# EAGLE design 2021-02-15_HALO_Main_Board (EAGLE 9.1.3)
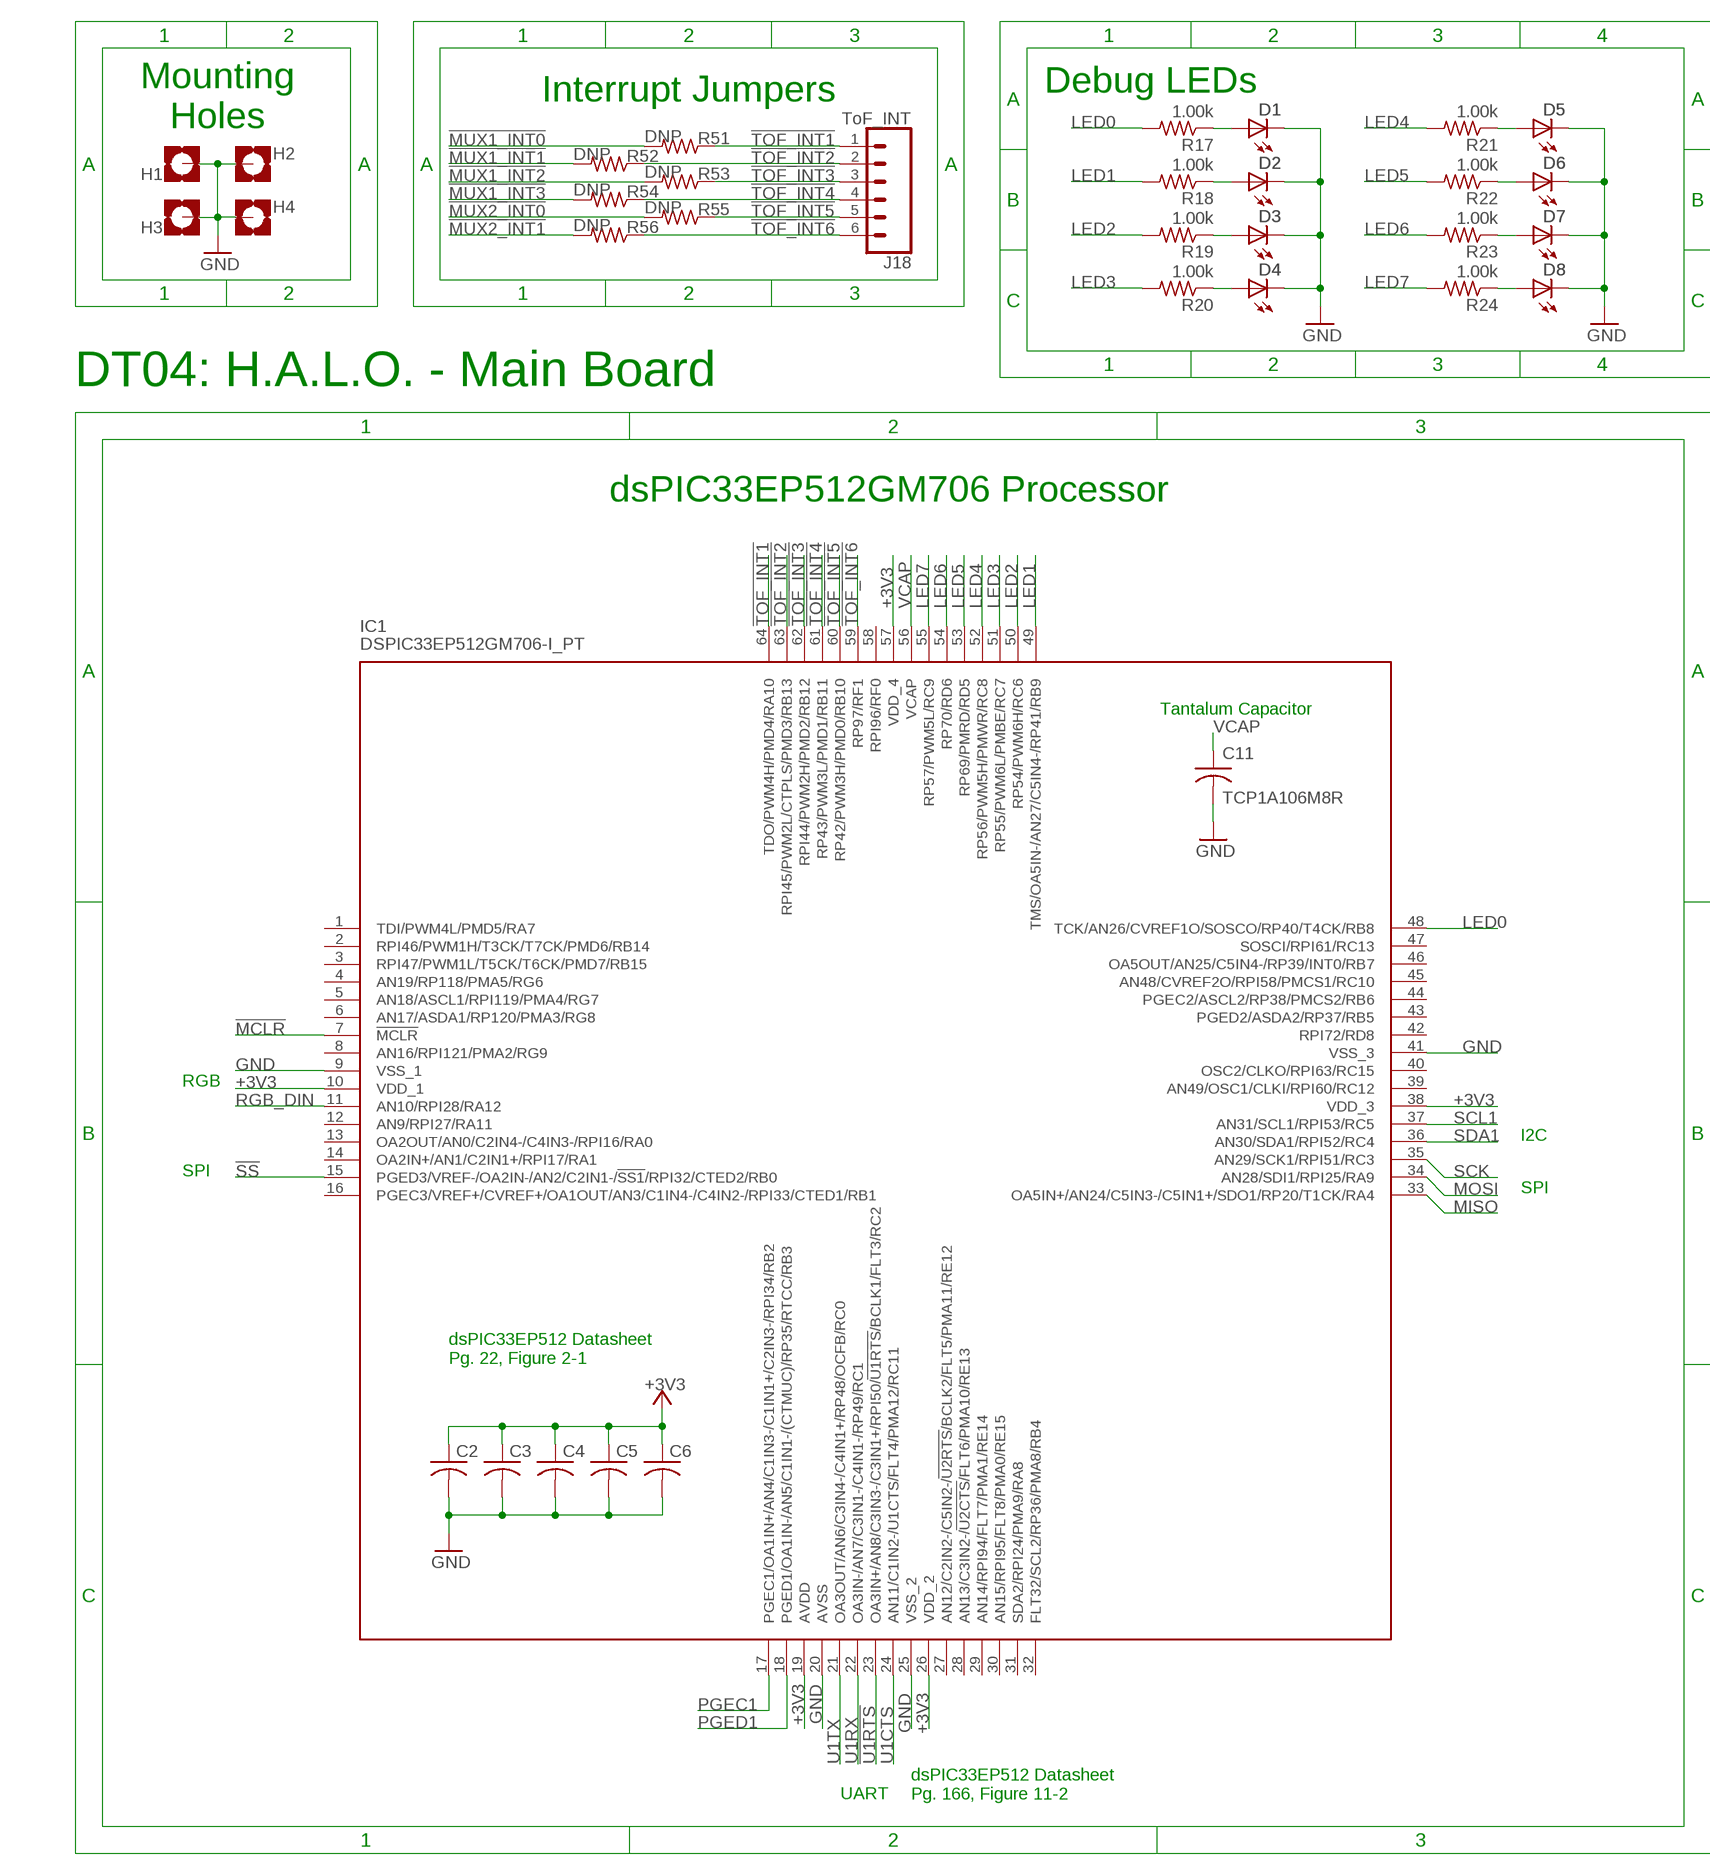
[diagram p0: schematic, sheet 1, part 1 of 2]
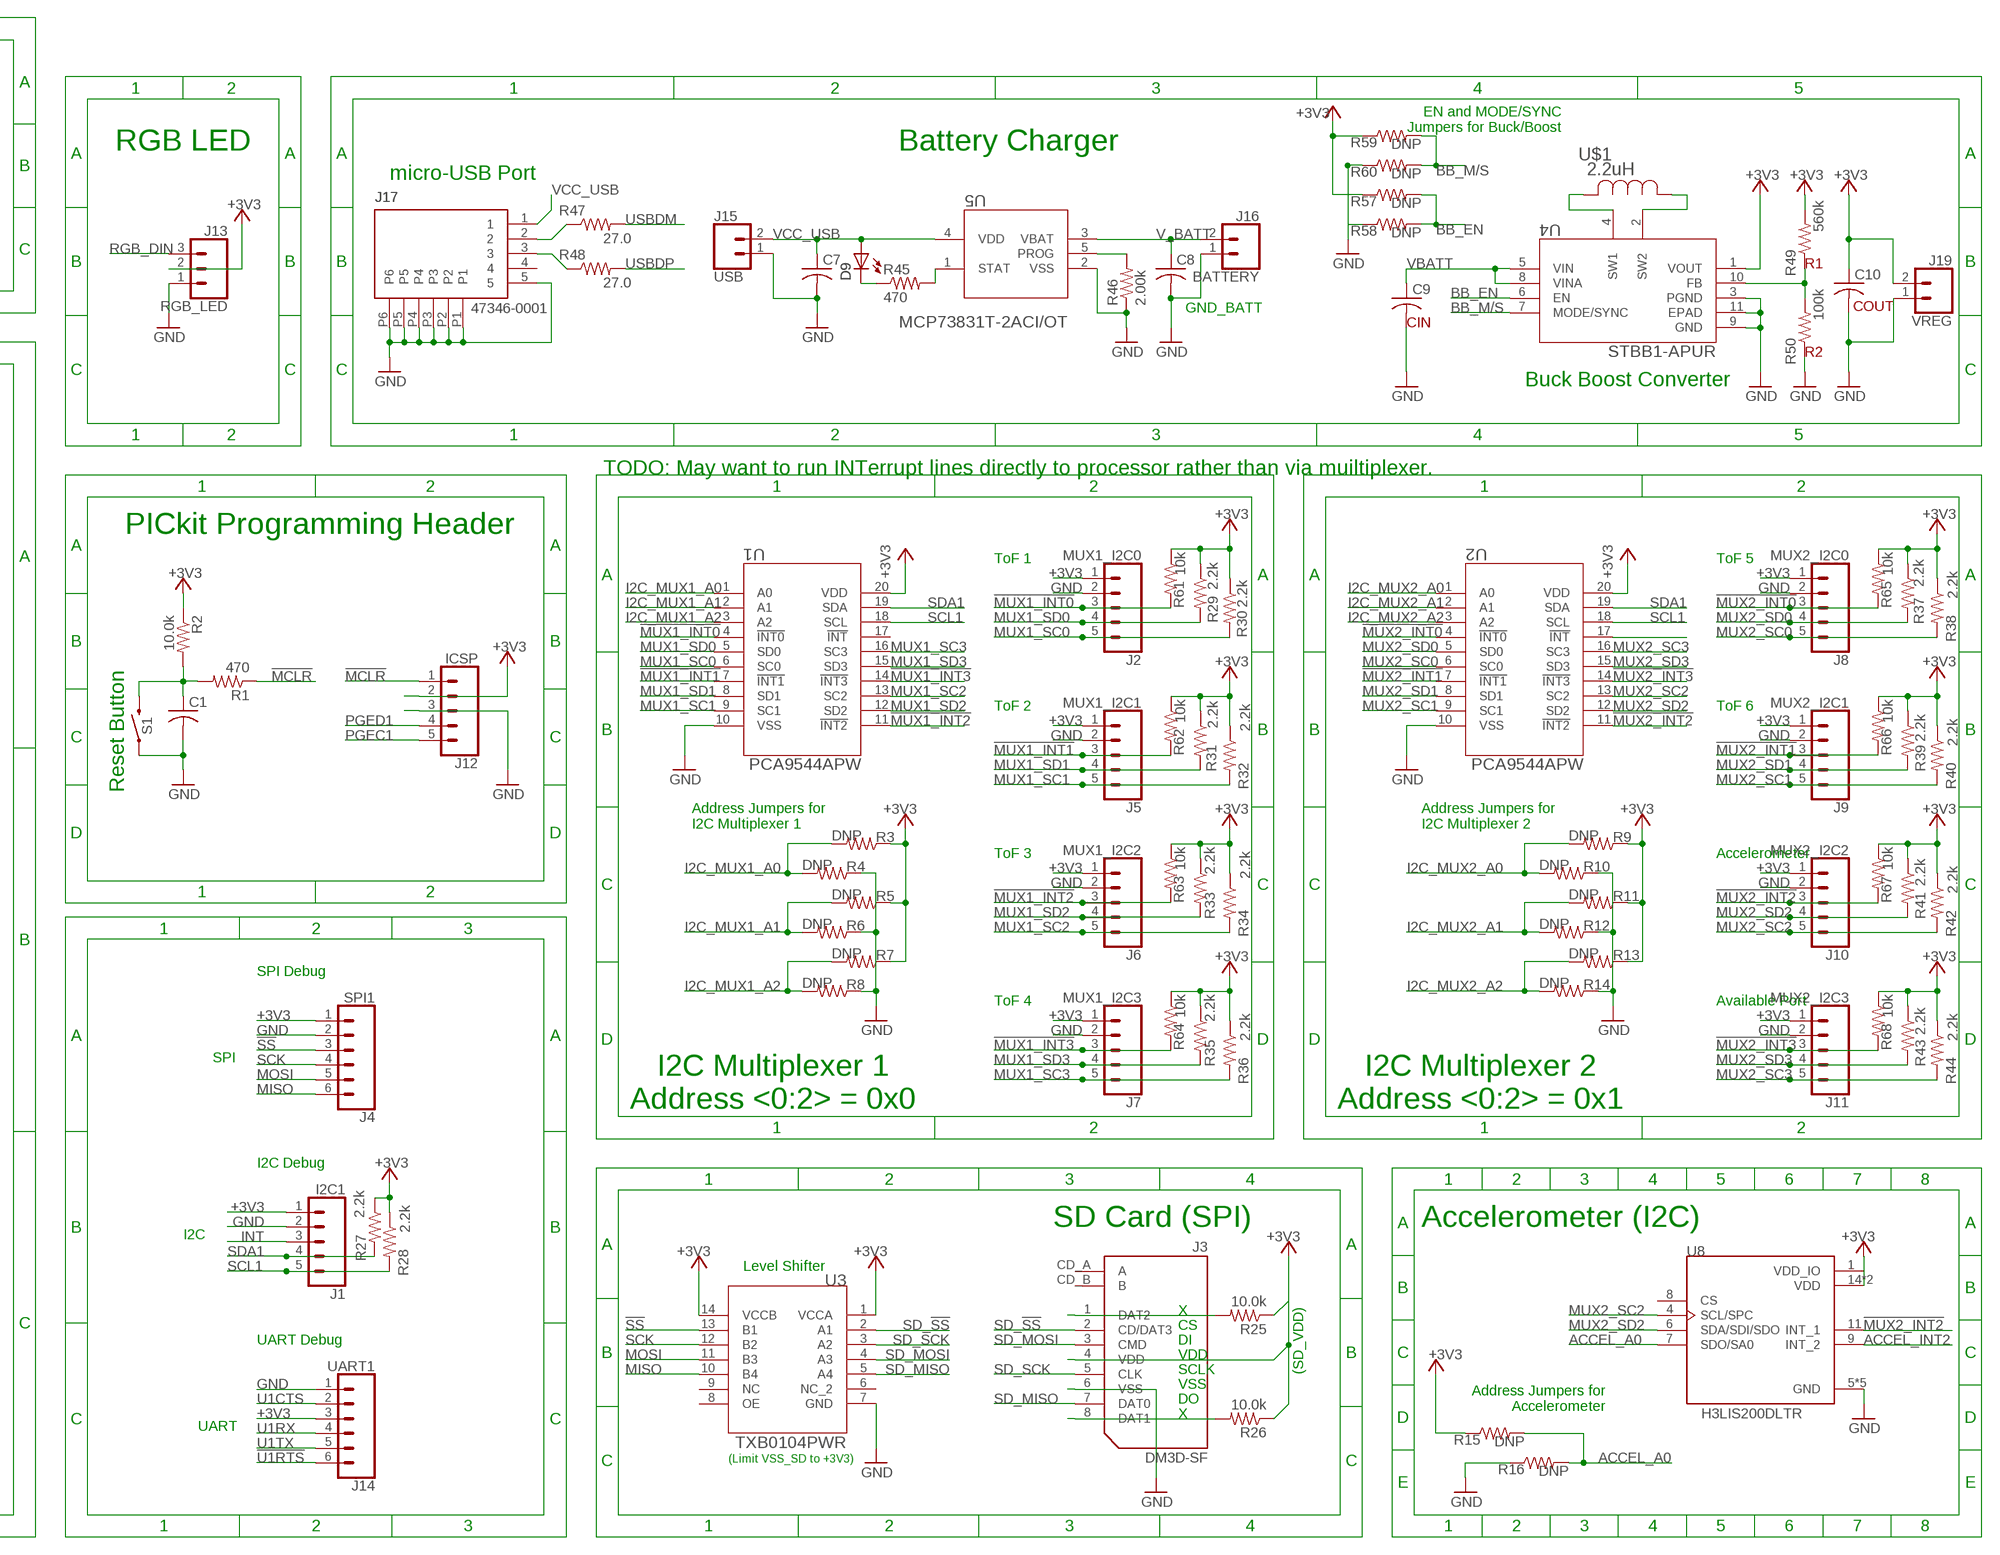
[diagram p1: schematic, sheet 1, part 2 of 2]

## Parts
C1  0.1uF  C-USC0805  [C0805]
C2  0.1uF  C-USC0805  [C0805]
C3  0.1uF  C-USC0805  [C0805]
C4  0.1uF  C-USC0805  [C0805]
C5  0.1uF  C-USC0805  [C0805]
C6  0.1uF  C-USC0805  [C0805]
C7  4.7uF  C-USC0805  [C0805]
C8  4.7uF  C-USC0805  [C0805]
C9  10uF  C-USC0805  [C0805]
C10  22uF  C-USC0805  [C0805]
C11  TCP1A106M8R  [TCP_ROM]
D1  CHIP-LED0805  [CHIP-LED0805]
D2  CHIP-LED0805  [CHIP-LED0805]
D3  CHIP-LED0805  [CHIP-LED0805]
D4  CHIP-LED0805  [CHIP-LED0805]
D5  CHIP-LED0805  [CHIP-LED0805]
D6  CHIP-LED0805  [CHIP-LED0805]
D7  CHIP-LED0805  [CHIP-LED0805]
D8  CHIP-LED0805  [CHIP-LED0805]
D9  CHIP-LED0805  [CHIP-LED0805]
H1  MOUNT-PAD-SQUARE3.0  [3,0-PAD-SQUARE]
H2  MOUNT-PAD-SQUARE3.0  [3,0-PAD-SQUARE]
H3  MOUNT-PAD-SQUARE3.0  [3,0-PAD-SQUARE]
H4  MOUNT-PAD-SQUARE3.0  [3,0-PAD-SQUARE]
IC1  DSPIC33EP512GM706-I_PT  [QFP50P1200X1200X120-64N]
J1  I2C1  CONN_05  [1X05]
J2  MUX1_I2C0  CONN_05  [1X05]
J3  DM3D-SF  AS-ITM-00047  [SD_CARD]
J4  SPI1  CONN_06SILK_FEMALE_PTH  [1X06]
J5  MUX1_I2C1  CONN_05  [1X05]
J6  MUX1_I2C2  CONN_05  [1X05]
J7  MUX1_I2C3  CONN_05  [1X05]
J8  MUX2_I2C0  CONN_05  [1X05]
J9  MUX2_I2C1  CONN_05  [1X05]
J10  MUX2_I2C2  CONN_05  [1X05]
J11  MUX2_I2C3  CONN_05  [1X05]
J12  ICSP  CONN_05  [1X05]
J13  RGB_LED  CONN_03LOCK  [1X03_LOCK]
J14  UART1  CONN_06SILK_FEMALE_PTH  [1X06]
J15  USB  CONN_02  [1X02]
J16  BATTERY  CONN_02  [1X02]
J17  47346-0001  AS-ITM-00021  [MICRO_USB]
J18  ToF_INT  CONN_06SILK_FEMALE_PTH  [1X06]
J19  VREG  CONN_02  [1X02]
R1  470  R-US_R0805  [R0805]
R2  10.0k  R-US_R0805  [R0805]
R3  DNP  R-US_R0805  [R0805]
R4  DNP  R-US_R0805  [R0805]
R5  DNP  R-US_R0805  [R0805]
R6  DNP  R-US_R0805  [R0805]
R7  DNP  R-US_R0805  [R0805]
R8  DNP  R-US_R0805  [R0805]
R9  DNP  R-US_R0805  [R0805]
R10  DNP  R-US_R0805  [R0805]
R11  DNP  R-US_R0805  [R0805]
R12  DNP  R-US_R0805  [R0805]
R13  DNP  R-US_R0805  [R0805]
R14  DNP  R-US_R0805  [R0805]
R15  DNP  R-US_R0805  [R0805]
R16  DNP  R-US_R0805  [R0805]
R17  1.00k  R-US_R0805  [R0805]
R18  1.00k  R-US_R0805  [R0805]
R19  1.00k  R-US_R0805  [R0805]
R20  1.00k  R-US_R0805  [R0805]
R21  1.00k  R-US_R0805  [R0805]
R22  1.00k  R-US_R0805  [R0805]
R23  1.00k  R-US_R0805  [R0805]
R24  1.00k  R-US_R0805  [R0805]
R25  10.0k  R-US_R0805  [R0805]
R26  10.0k  R-US_R0805  [R0805]
R27  2.2k  R-US_R0805  [R0805]
R28  2.2k  R-US_R0805  [R0805]
R29  2.2k  R-US_R0805  [R0805]
R30  2.2k  R-US_R0805  [R0805]
R31  2.2k  R-US_R0805  [R0805]
R32  2.2k  R-US_R0805  [R0805]
R33  2.2k  R-US_R0805  [R0805]
R34  2.2k  R-US_R0805  [R0805]
R35  2.2k  R-US_R0805  [R0805]
R36  2.2k  R-US_R0805  [R0805]
R37  2.2k  R-US_R0805  [R0805]
R38  2.2k  R-US_R0805  [R0805]
R39  2.2k  R-US_R0805  [R0805]
R40  2.2k  R-US_R0805  [R0805]
R41  2.2k  R-US_R0805  [R0805]
R42  2.2k  R-US_R0805  [R0805]
R43  2.2k  R-US_R0805  [R0805]
R44  2.2k  R-US_R0805  [R0805]
R45  470  R-US_R0805  [R0805]
R46  2.00k  R-US_R0805  [R0805]
R47  27.0  R-US_R0805  [R0805]
R48  27.0  R-US_R0805  [R0805]
R49  560k  R-US_R0805  [R0805]
R50  100k  R-US_R0805  [R0805]
R51  DNP  R-US_R0805  [R0805]
R52  DNP  R-US_R0805  [R0805]
R53  DNP  R-US_R0805  [R0805]
R54  DNP  R-US_R0805  [R0805]
R55  DNP  R-US_R0805  [R0805]
R56  DNP  R-US_R0805  [R0805]
R57  DNP  R-US_R0805  [R0805]
R58  DNP  R-US_R0805  [R0805]
R59  DNP  R-US_R0805  [R0805]
R60  DNP  R-US_R0805  [R0805]
R61  10k  R-US_R0805  [R0805]
R62  10k  R-US_R0805  [R0805]
R63  10k  R-US_R0805  [R0805]
R64  10k  R-US_R0805  [R0805]
R65  10k  R-US_R0805  [R0805]
R66  10k  R-US_R0805  [R0805]
R67  10k  R-US_R0805  [R0805]
R68  10k  R-US_R0805  [R0805]
S1  SWITCH-MOMENTARY-2SMD-4  [TACTILE_SWITCH_TALL]
U1  PCA9544APW  [SOT360-1_NXP]
U2  PCA9544APW  [SOT360-1_NXP]
U3  TXB0104PWR  [PW14]
U4  STBB1-APUR  [SON_B1-APUR_STM]
U5  MCP73831T-2ACI/OT  [SOT-23-5_MC_MCH]
U8  H3LIS200DLTR  [PQFN50P300X300X100-16N]
U$1  2.2uH  IND  [IND_4028_TDK]

## Nets
!MCLR: IC1.7(!MCLR) J12.1 R1.1
!MUX1_INT0: J2.3 R51.2 R61.2 U1.4(!INT0)
!MUX1_INT1: J5.3 R52.2 R62.2 U1.7(!INT1)
!MUX1_INT2: J6.3 R53.2 R63.2 U1.11(!INT2)
!MUX1_INT3: J7.3 R54.2 R64.2 U1.14(!INT3)
!MUX2_INT0: J8.3 R55.2 R65.2 U2.4(!INT0)
!MUX2_INT1: J9.3 R56.2 R66.2 U2.7(!INT1)
!MUX2_INT2: J10.3 R67.2 U2.11(!INT2) U8.11(INT_1)
!MUX2_INT3: J11.3 R68.2 U2.14(!INT3)
!SS: IC1.15(PGED3/VREF-/OA2IN-/AN2/C2IN1-/!SS1!/RPI32/CTED2/RB0) J4.3 U3.13(B1)
!TOF_INT1: IC1.64(TDO/PWM4H/PMD4/RA10) J18.1 R51.1
!TOF_INT2: IC1.63(RPI45/PWM2L/CTPLS/PMD3/RB13) J18.2 R52.1
!TOF_INT3: IC1.62(RPI44/PWM2H/PMD2/RB12) J18.3 R53.1
!TOF_INT4: IC1.61(RP43/PWM3L/PMD1/RB11) J18.4 R54.1
!TOF_INT5: IC1.60(RP42/PWM3H/PMD0/RB10) J18.5 R55.1
!TOF_INT6: IC1.59(RP97/RF1) J18.6 R56.1
!U1RTS: IC1.23(OA3IN+/AN8/C3IN3-/C3IN1+/RPI50/!U1RTS!/BCLK1/FLT3/RC2) J14.6
+3V3: C2.1 C3.1 C4.1 C5.1 C6.1 C10.1 IC1.10(VDD_1) IC1.19(AVDD) IC1.26(VDD_2) IC1.38(VDD_3) IC1.57(VDD_4) J1.1 J2.1 J3.4(VDD) J4.1 J5.1 J6.1 J7.1 J8.1 J9.1 J10.1 J11.1 J12.2 J13.2 J14.3 J19.2 R2.1 R3.1 R5.1 R7.1 R9.1 R11.1 R13.1 R15.1 R25.1 R26.1 R27.1 R28.1 R29.1 R30.1 R31.1 R32.1 R33.1 R34.1 R35.1 R36.1 R37.1 R38.1 R39.1 R40.1 R41.1 R42.1 R43.1 R44.1 R49.2 R57.1 R59.1 R61.1 R62.1 R63.1 R64.1 R65.1 R66.1 R67.1 R68.1 U1.20(VDD) U2.20(VDD) U3.1(VCCA) U3.14(VCCB) U4.1(VOUT) U8.1(VDD_IO) U8.14(VDD) U8.15(VDD)
ACCEL_A0: R15.2 R16.2 U8.7(SDO/SA0)
ACCEL_INT2: U8.9(INT_2)
BB_EN: R57.2 R58.2 U4.6(EN)
BB_M/S: R59.2 R60.2 U4.7(MODE/SYNC)
GND: C1.2 C2.2 C3.2 C4.2 C5.2 C6.2 C7.2 C8.2 C9.2 C10.2 C11.2 D1.C D2.C D3.C D4.C D5.C D6.C D7.C D8.C H1.B3,0(MOUNT) H2.B3,0(MOUNT) H3.B3,0(MOUNT) H4.B3,0(MOUNT) IC1.9(VSS_1) IC1.20(AVSS) IC1.25(VSS_2) IC1.41(VSS_3) J1.2 J2.2 J3.6(VSS) J4.2 J5.2 J6.2 J7.2 J8.2 J9.2 J10.2 J11.2 J12.3 J13.1 J14.1 J15.1 J16.1 J17.5 J17.P1 J17.P2 J17.P3 J17.P4 J17.P5 J17.P6 J19.1 R4.1 R6.1 R8.1 R10.1 R12.1 R14.1 R16.1 R46.1 R50.1 R58.1 R60.1 S1.A2 U1.10(VSS) U2.10(VSS) U3.7(GND) U4.3(PGND) U4.9(GND) U4.11(EPAD) U5.2(VSS) U8.5(GND) U8.10(GND) U8.12(GND) U8.13(GND) U8.16(GND)
I2C_MUX1_A0: R3.2 R4.2 U1.1(A0)
I2C_MUX1_A1: R5.2 R6.2 U1.2(A1)
I2C_MUX1_A2: R7.2 R8.2 U1.3(A2)
I2C_MUX2_A0: R9.2 R10.2 U2.1(A0)
I2C_MUX2_A1: R11.2 R12.2 U2.2(A1)
I2C_MUX2_A2: R13.2 R14.2 U2.3(A2)
INT: J1.3
LED0: IC1.48(TCK/AN26/CVREF1O/SOSCO/RP40/T4CK/RB8) R17.2
LED1: IC1.49(TMS/OA5IN-/AN27/C5IN4-/RP41/RB9) R18.2
LED2: IC1.50(RP54/PWM6H/RC6) R19.2
LED3: IC1.51(RP55/PWM6L/PMBE/RC7) R20.2
LED4: IC1.52(RP56/PWM5H/PMWR/RC8) R21.2
LED5: IC1.53(RP69/PMRD/RD5) R22.2
LED6: IC1.54(RP70/RD6) R23.2
LED7: IC1.55(RP57/PWM5L/RC9) R24.2
MISO: IC1.33(OA5IN+/AN24/C5IN3-/C5IN1+/SDO1/RP20/T1CK/RA4) J4.6 U3.10(B4)
MOSI: IC1.34(AN28/SDI1/RPI25/RA9) J4.5 U3.11(B3)
MUX1_SC0: J2.5 R30.2 U1.6(SC0)
MUX1_SC1: J5.5 R32.2 U1.9(SC1)
MUX1_SC2: J6.5 R34.2 U1.13(SC2)
MUX1_SC3: J7.5 R36.2 U1.16(SC3)
MUX1_SD0: J2.4 R29.2 U1.5(SD0)
MUX1_SD1: J5.4 R31.2 U1.8(SD1)
MUX1_SD2: J6.4 R33.2 U1.12(SD2)
MUX1_SD3: J7.4 R35.2 U1.15(SD3)
MUX2_SC0: J8.5 R38.2 U2.6(SC0)
MUX2_SC1: J9.5 R40.2 U2.9(SC1)
MUX2_SC2: J10.5 R42.2 U2.13(SC2) U8.4(SCL/SPC)
MUX2_SC3: J11.5 R44.2 U2.16(SC3)
MUX2_SD0: J8.4 R37.2 U2.5(SD0)
MUX2_SD1: J9.4 R39.2 U2.8(SD1)
MUX2_SD2: J10.4 R41.2 U2.12(SD2) U8.6(SDA/SDI/SDO)
MUX2_SD3: J11.4 R43.2 U2.15(SD3)
N$1: C1.1 R1.2 R2.2 S1.B2
N$3: J3.8(DAT1) R26.2
N$4: J3.1(DAT2) R25.2
N$5: D1.A R17.1
N$6: J17.2 R47.1
N$7: D2.A R18.1
N$8: D9.C R45.1
N$9: R49.1 R50.2 U4.10(FB)
N$10: D3.A R19.1
N$11: D4.A R20.1
N$12: D5.A R21.1
N$13: D6.A R22.1
N$14: D7.A R23.1
N$15: D8.A R24.1
N$16: R45.2 U5.1(STAT)
N$17: J17.3 R48.1
N$18: U4.4(SW1) U$1.2
N$19: R46.2 U5.5(PROG)
N$20: U4.2(SW2) U$1.1
N$25: U2.17(!INT)
PGEC1: IC1.17(PGEC1/OA1IN+/AN4/C1IN3-/C1IN1+/C2IN3-/RPI34/RB2) J12.5
PGED1: IC1.18(PGED1/OA1IN-/AN5/C1IN1-/(CTMUC)/RP35/RTCC/RB3) J12.4
RGB_DIN: IC1.11(AN10/RPI28/RA12) J13.3
SCK: IC1.35(AN29/SCK1/RPI51/RC3) J4.4 U3.12(B2)
SCL1: IC1.37(AN31/SCL1/RPI53/RC5) J1.5 R28.2 U1.18(SCL) U2.18(SCL)
SD_!SS: J3.2(CD/DAT3) U3.2(A1)
SD_MISO: J3.7(DAT0) U3.5(A4)
SD_MOSI: J3.3(CMD) U3.4(A3)
SD_SCK: J3.5(CLK) U3.3(A2)
SDA1: IC1.36(AN30/SDA1/RPI52/RC4) J1.4 R27.2 U1.19(SDA) U2.19(SDA)
U1CTS: IC1.24(AN11/C1IN2-/U1CTS/FLT4/PMA12/RC11) J14.2
U1RX: IC1.22(OA3IN-/AN7/C3IN1-/C4IN1-/RP49/RC1) J14.4
U1TX: IC1.21(OA3OUT/AN6/C3IN4-/C4IN1+/RP48/OCFB/RC0) J14.5
USBDM: R47.2
USBDP: R48.2
V_BATT: C8.1 J16.2 U5.3(VBAT)
VBATT: C9.1 U4.5(VIN) U4.8(VINA)
VCAP: C11.1 IC1.56(VCAP)
VCC_USB: C7.1 D9.A J15.2 J17.1 U5.4(VDD)
Unconnected: IC1.1(TDI/PWM4L/PMD5/RA7) IC1.2(RPI46/PWM1H/T3CK/T7CK/PMD6/RB14) IC1.3(RPI47/PWM1L/T5CK/T6CK/PMD7/RB15) IC1.4(AN19/RP118/PMA5/RG6) IC1.5(AN18/ASCL1/RPI119/PMA4/RG7) IC1.6(AN17/ASDA1/RP120/PMA3/RG8) IC1.8(AN16/RPI121/PMA2/RG9) IC1.12(AN9/RPI27/RA11) IC1.13(OA2OUT/AN0/C2IN4-/C4IN3-/RPI16/RA0) IC1.14(OA2IN+/AN1/C2IN1+/RPI17/RA1) IC1.16(PGEC3/VREF+/CVREF+/OA1OUT/AN3/C1IN4-/C4IN2-/RPI33/CTED1/RB1) IC1.27(AN12/C2IN2-/C5IN2-/!U2RTS!/BCLK2/FLT5/PMA11/RE12) IC1.28(AN13/C3IN2-/!U2CTS!/FLT6/PMA10/RE13) IC1.29(AN14/RPI94/FLT7/PMA1/RE14) IC1.30(AN15/RPI95/FLT8/PMA0/RE15) IC1.31(SDA2/RPI24/PMA9/RA8) IC1.32(FLT32/SCL2/RP36/PMA8/RB4) IC1.39(AN49/OSC1/CLKI/RPI60/RC12) IC1.40(OSC2/CLKO/RPI63/RC15) IC1.42(RPI72/RD8) IC1.43(PGED2/ASDA2/RP37/RB5) IC1.44(PGEC2/ASCL2/RP38/PMCS2/RB6) IC1.45(AN48/CVREF2O/RPI58/PMCS1/RC10) IC1.46(OA5OUT/AN25/C5IN4-/RP39/INT0/RB7) IC1.47(SOSCI/RPI61/RC13) IC1.58(RPI96/RF0) J3.CD_A(A) J3.CD_B(B) J17.4 U1.17(!INT) U3.6(NC_2) U3.8(OE) U3.9(NC) U8.8(CS)

## Notes on the sheet
- Interrupt Jumpers | Debug LEDs
- Mounting
  Holes
- EN and MODE/SYNC
  Jumpers for Buck/Boost
- RGB LED | Battery Charger
- micro-USB Port
- R1
- GND_BATT | COUT
- DT04: H.A.L.O. - Main Board
- CIN
- R2
- Buck Boost Converter
- dsPIC33EP512GM706 Processor
- TODO: May want to run INTerrupt lines directly to processor rather than via muiltiplexer.
- PICkit Programming Header
- ToF 1 | ToF 5
- Tantalum Capacitor
- ToF 2 | ToF 6
- Reset Button
- Address Jumpers for
  I2C Multiplexer 1
- Address Jumpers for
  I2C Multiplexer 2
- ToF 3 | Accelerometer
- ┏ 
  RGB
       ┃
       ┗
- ┓ 
   I2C
  ┛
- SPI Debug
- ┏ 
  SPI
     ┗
- ToF 4 | Available Port
- ┓ 
   SPI
  ┃ 
  ┛
- ┏ 
     ┃
     ┃
  SPI
     ┃
     ┃
     ┗
- I2C Multiplexer 1
  Address <0:2> = 0x0
- I2C Multiplexer 2
  Address <0:2> = 0x1
- dsPIC33EP512 Datasheet
  Pg. 22, Figure 2-1
- I2C Debug
- SD Card (SPI) | Accelerometer (I2C)
- Level Shifter
- ┏ 
     ┃
  I2C
     ┃
     ┃
     ┗
- X
- CS
- UART Debug | DI
- VDD
- SCLK | (SD_VDD)
- VSS
- DO
- Address Jumpers for
  Accelerometer
- X
- (Limit VSS_SD to +3V3)
- ┏ 
        ┃
        ┃
  UART
        ┃
        ┃
        ┗
- ┗ UART┛
- dsPIC33EP512 Datasheet
  Pg. 166, Figure 11-2

## Library data of the parts
C1-C10 = rcl:C-US: CAPACITOR, American symbol
C11 = HALO_Tant_Cap_Library:TCP1A106M8R; BUILT_BY: EMA_UL_Team; MANUFACTURER_PART_NUMBER: TCP1A106M8R; SOURCELIBRARY: Rohm_2014-12-31; VENDOR: ROHM Semiconductor
D1-D9 = UA_NASA_RMC-Diodes:CHIP-LED0805
H1-H4 = holes:MOUNT-PAD-SQUARE: MOUNTING PAD, square
IC1 = SamacSys_Parts:DSPIC33EP512GM706-I_PT: Microchip DSPIC33EP512GM706-I/PT, 16bit dsPIC Microcontroller, 60MHz, 512 kB Flash, 64-Pin TQFP Source: Datasheet <http://www.microchip.com/mymicrochip/filehandler.aspx?ddocname=en561674>; ARROW_PART_NUMBER: DSPIC33EP512GM706-I/PT; ARROW_PRICE-STOCK: https://www.arrow.com/en/products/dspic33ep512gm706-ipt/microchip-technology; DESCRIPTION: Microchip DSPIC33EP512GM706-I/PT, 16bit dsPIC Microcontroller, 60MHz, 512 kB Flash, 64-Pin TQFP; HEIGHT: 1.2mm; MANUFACTURER_NAME: Microchip; MANUFACTURER_PART_NUMBER: DSPIC33EP512GM706-I/PT; MOUSER_PART_NUMBER: 579-512GM706-I/PT; MOUSER_PRICE-STOCK: https://www.mouser.com/Search/Refine.aspx?Keyword=579-512GM706-I%2FPT
J1 J2 J5-J12 = SparkFun-Connectors:CONN_05: Multi connection point. Often used as Generic Header-pin footprint for 0.1 inch spaced/style header connections On any of the 0.1 inch spaced packages, you can populate with these: Break Away Headers - Straight <https://www.sparkfun.com/products/116> (PRT-00116) Break Away Male Headers - Right Angle <https://www.sparkfun.com/products/553> (PRT-00553) Female Headers <https://www.sparkfun.com/products/115> (PRT-00115) Break Away Headers - Machine Pin <https://www.sparkfun.com/products/117> (PRT-00117) Break Away Female Headers - Swiss Machine Pin <https://www.sparkfun.com/products/743> (PRT-00743) For SCREWTERMINALS and SPRING TERMINALS visit here: Screw Terimnals on SparkFun.com <https://www.sparkfun.com/search/results?term=Screw+Terminals> (5mm/3.5mm/2.54mm spacing) This device is also useful as a general connection point to wire up your design to another part of your project. Our various solder wires solder well into these plated through hole pads. Hook-Up Wire - Assortment (Stranded, 22 AWG) <https://www.sparkfun.com/products/11375> (PRT-11375) Hook-Up Wire - Assortment (Solid Core, 22 AWG) <https://www.sparkfun.com/products/11367> (PRT-11367) View the entire wire category on our website here <https://www.sparkfun.com/categories/141> Special notes: Molex polarized connector foot print use with SKU : PRT-08231 with associated crimp pins and housings. 1MM SMD Version SKU: PRT-10208
J3 = tinycircuits:AS-ITM-00047: CONN MICRO SD R/A PUSH-PULL SMD; PARTNO: AS-ITM-00047; PNPROTATION: 270
J4 J14 J18 = SparkFun-Connectors:CONN_06: Multi connection point. Often used as Generic Header-pin footprint for 0.1 inch spaced/style header connections On any of the 0.1 inch spaced packages, you can populate with these: Break Away Headers - Straight <https://www.sparkfun.com/products/116> (PRT-00116) Break Away Male Headers - Right Angle <https://www.sparkfun.com/products/553> (PRT-00553) Female Headers <https://www.sparkfun.com/products/115> (PRT-00115) Break Away Headers - Machine Pin <https://www.sparkfun.com/products/117> (PRT-00117) Break Away Female Headers - Swiss Machine Pin <https://www.sparkfun.com/products/743> (PRT-00743) Arduino Stackable Header - 6 Pin <https://www.sparkfun.com/products/9280> (PRT-09280) For SCREWTERMINALS and SPRING TERMINALS visit here: Screw Terimnals on SparkFun.com <https://www.sparkfun.com/search/results?term=Screw+Terminals> (5mm/3.5mm/2.54mm spacing) This device is also useful as a general connection point to wire up your design to another part of your project. Our various solder wires solder well into these plated through hole pads. Hook-Up Wire - Assortment (Stranded, 22 AWG) <https://www.sparkfun.com/products/11375> (PRT-11375) Hook-Up Wire - Assortment (Solid Core, 22 AWG) <https://www.sparkfun.com/products/11367> (PRT-11367) View the entire wire category on our website here <https://www.sparkfun.com/categories/141>; PROD_ID: CONN-08437
J13 = SparkFun-Connectors:CONN_03: Multi connection point. Often used as Generic Header-pin footprint for 0.1 inch spaced/style header connections On any of the 0.1 inch spaced packages, you can populate with these: Break Away Headers - Straight <https://www.sparkfun.com/products/116> (PRT-00116) Break Away Male Headers - Right Angle <https://www.sparkfun.com/products/553> (PRT-00553) Female Headers <https://www.sparkfun.com/products/115> (PRT-00115) Break Away Headers - Machine Pin <https://www.sparkfun.com/products/117> (PRT-00117) Break Away Female Headers - Swiss Machine Pin <https://www.sparkfun.com/products/743> (PRT-00743) Stackable Header - 3 Pin (Female, 0.1") <https://www.sparkfun.com/products/13875> (PRT-13875) For SCREWTERMINALS and SPRING TERMINALS visit here: Screw Terimnals on SparkFun.com <https://www.sparkfun.com/search/results?term=Screw+Terminals> (5mm/3.5mm/2.54mm spacing) This device is also useful as a general connection point to wire up your design to another part of your project. Our various solder wires solder well into these plated through hole pads. Hook-Up Wire - Assortment (Stranded, 22 AWG) <https://www.sparkfun.com/products/11375> (PRT-11375) Hook-Up Wire - Assortment (Solid Core, 22 AWG) <https://www.sparkfun.com/products/11367> (PRT-11367) View the entire wire category on our website here <https://www.sparkfun.com/categories/141> Special notes: Molex polarized connector foot print use with SKU : PRT-08232 with associated crimp pins and housings.
J15 J16 J19 = SparkFun-Connectors:CONN_02: Multi connection point. Often used as Generic Header-pin footprint for 0.1 inch spaced/style header connections On any of the 0.1 inch spaced packages, you can populate with these: Break Away Headers - Straight <https://www.sparkfun.com/products/116> (PRT-00116) Break Away Male Headers - Right Angle <https://www.sparkfun.com/products/553> (PRT-00553) Female Headers <https://www.sparkfun.com/products/115> (PRT-00115) Break Away Headers - Machine Pin <https://www.sparkfun.com/products/117> (PRT-00117) Break Away Female Headers - Swiss Machine Pin <https://www.sparkfun.com/products/743> (PRT-00743) For SCREWTERMINALS and SPRING TERMINALS visit here: Screw Terimnals on SparkFun.com <https://www.sparkfun.com/search/results?term=Screw+Terminals> (5mm/3.5mm/2.54mm spacing) This device is also useful as a general connection point to wire up your design to another part of your project. Our various solder wires solder well into these plated through hole pads. Hook-Up Wire - Assortment (Stranded, 22 AWG) <https://www.sparkfun.com/products/11375> (PRT-11375) Hook-Up Wire - Assortment (Solid Core, 22 AWG) <https://www.sparkfun.com/products/11367> (PRT-11367) View the entire wire category on our website here <https://www.sparkfun.com/categories/141> Special notes: Molex polarized connector foot print use with: PRT-08233 with associated crimp pins and housings. 2.54_SCREWTERM for use with PRT-10571. 3.5mm Screw Terminal footprints for PRT-08084 5mm Screw Terminal footprints for use with PRT-08432
J17 = tinycircuits:AS-ITM-00021: CONN RCPT 5POS MICRO USB R/A; PARTNO: AS-ITM-00021; PNPROTATION: 90
R1-R68 = rcl:R-US_: RESISTOR, American symbol
S1 = UA_NASA_RMC-Switches:SWITCH-MOMENTARY-2: Various NO switches- pushbuttons, reed, etc Series: PTS645; PROD_ID: SWCH-11966
U1 U2 = I2C_Multiplexer:PCA9544APW; BUILT_BY: EMA_UL_Team; MANUFACTURER_PART_NUMBER: PCA9544APW; SOURCELIBRARY: NXP_2011-11-10; VENDOR: NXP
U3 = Level_Shifter_TXB0104PWR:TXB0104PWR; DATASHEET_URL: http://www.ti.com/lit/gpn/TXB0104; DESCRIPTION: 4-Bit Bidirectional Voltage-Level Translator with Auto Direction Sensing and +/-15 kV ESD Protect; FAMILY_NAME: AUTO DIRECTION SENSING DUAL SUPPLY TRANSLATOR; GENERIC_PART_NUMBER: TXB0104; INDUSTRY_STD_PKG_TYPE: TSSOP; MANUFACTURER: Texas Instruments; MANUFACTURER_PART_NUMBER: TXB0104PWR; PACKAGE_DESIGNATOR: PW; PIN_COUNT: 14; VENDOR: Texas Instruments
U4 = HALO_Buck_Boost:STBB1-APUR; BUILT_BY: EMA_Matt; DATASHEET: https://datasheet.octopart.com/STBB1-APUR-STMicroelectronics-datasheet-10837531.pdf; MANUFACTURER_PART_NUMBER: STBB1-APUR; SOURCELIBRARY: Updates_to_database_2020-11-13; VENDOR: STMicroelectronics
U5 = HALO_Batt_Charger:MCP73831T-2ACI/OT; BUILT_BY: EMA_UL_Team; MANUFACTURER_PART_NUMBER: MCP73831T-2ACI/OT; SOURCELIBRARY: Microchip_2011-05-13; VENDOR: Microchip
U8 = H3LIS200DLTR:H3LIS200DLTR: H3LIS200DL Series 3.6 V 400 Hz Low-Power 3-Axis Digital Accelerometer -TFLGA-16L; DESCRIPTION: Accelerometer X, Y, Z Axis ±100g, ±200g 25Hz ~ 500Hz 16-TFLGA (3x3); DIGI-KEY_PART_NUMBER: 497-15698-1-ND; MF: STMicroelectronics; MP: H3LIS200DLTR; PACKAGE: TFLGA-16 STMicroelectronics; PURCHASE-URL: https://pricing.snapeda.com/search/part/H3LIS200DLTR/?ref=eda
U$1 = HALO_L_Buck_Boost:IND

## Board
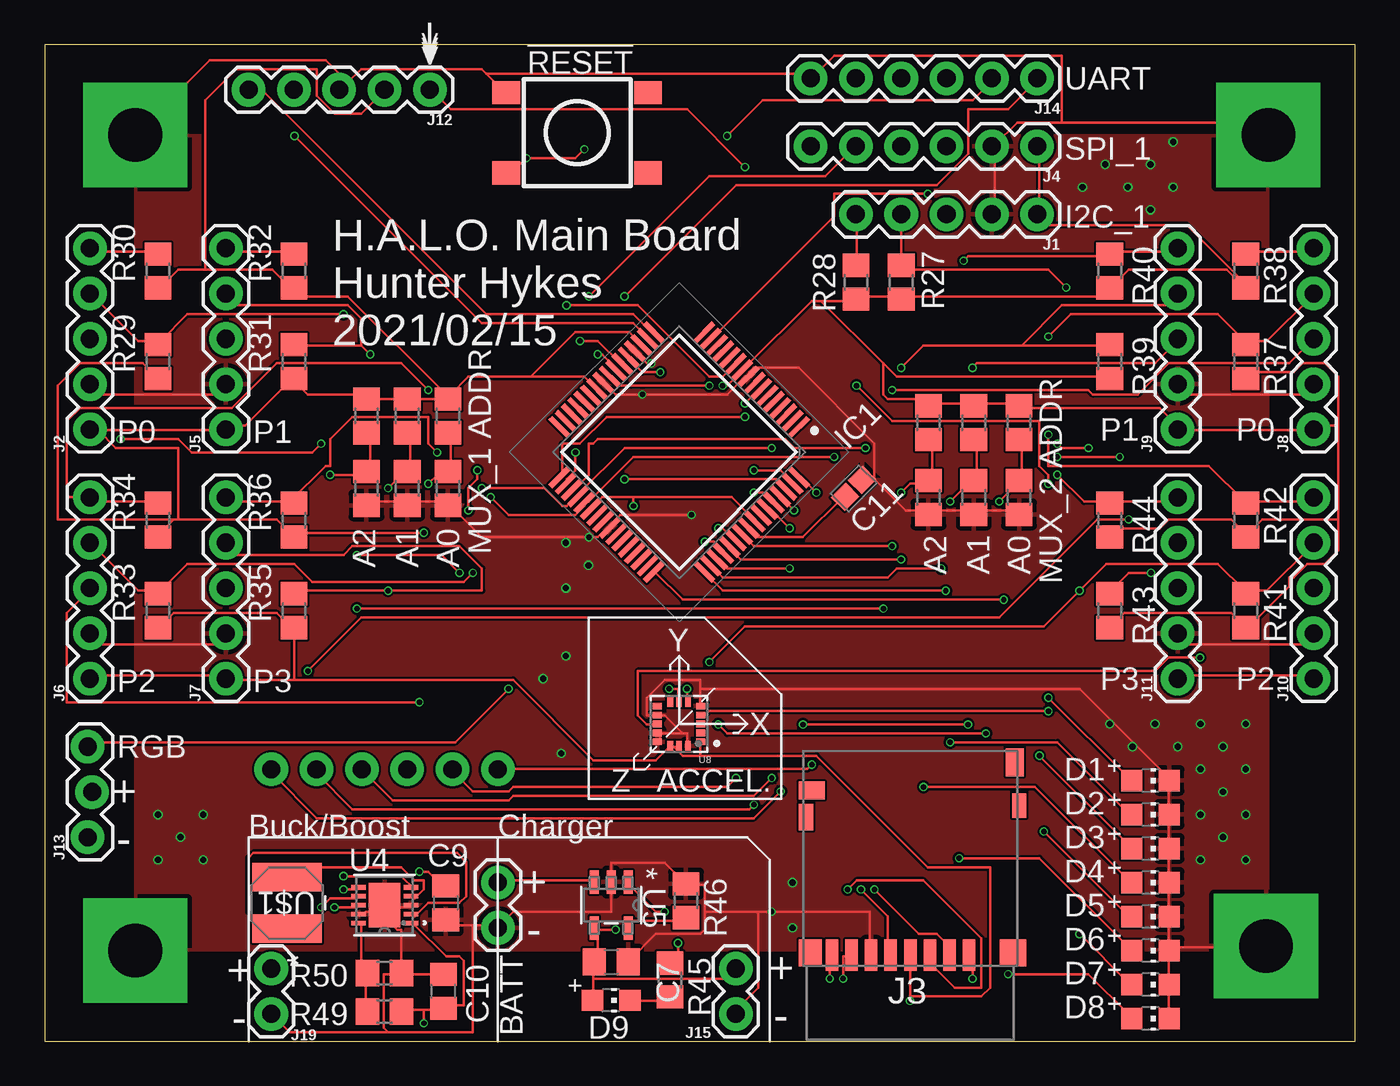
[diagram p2: board, top side]
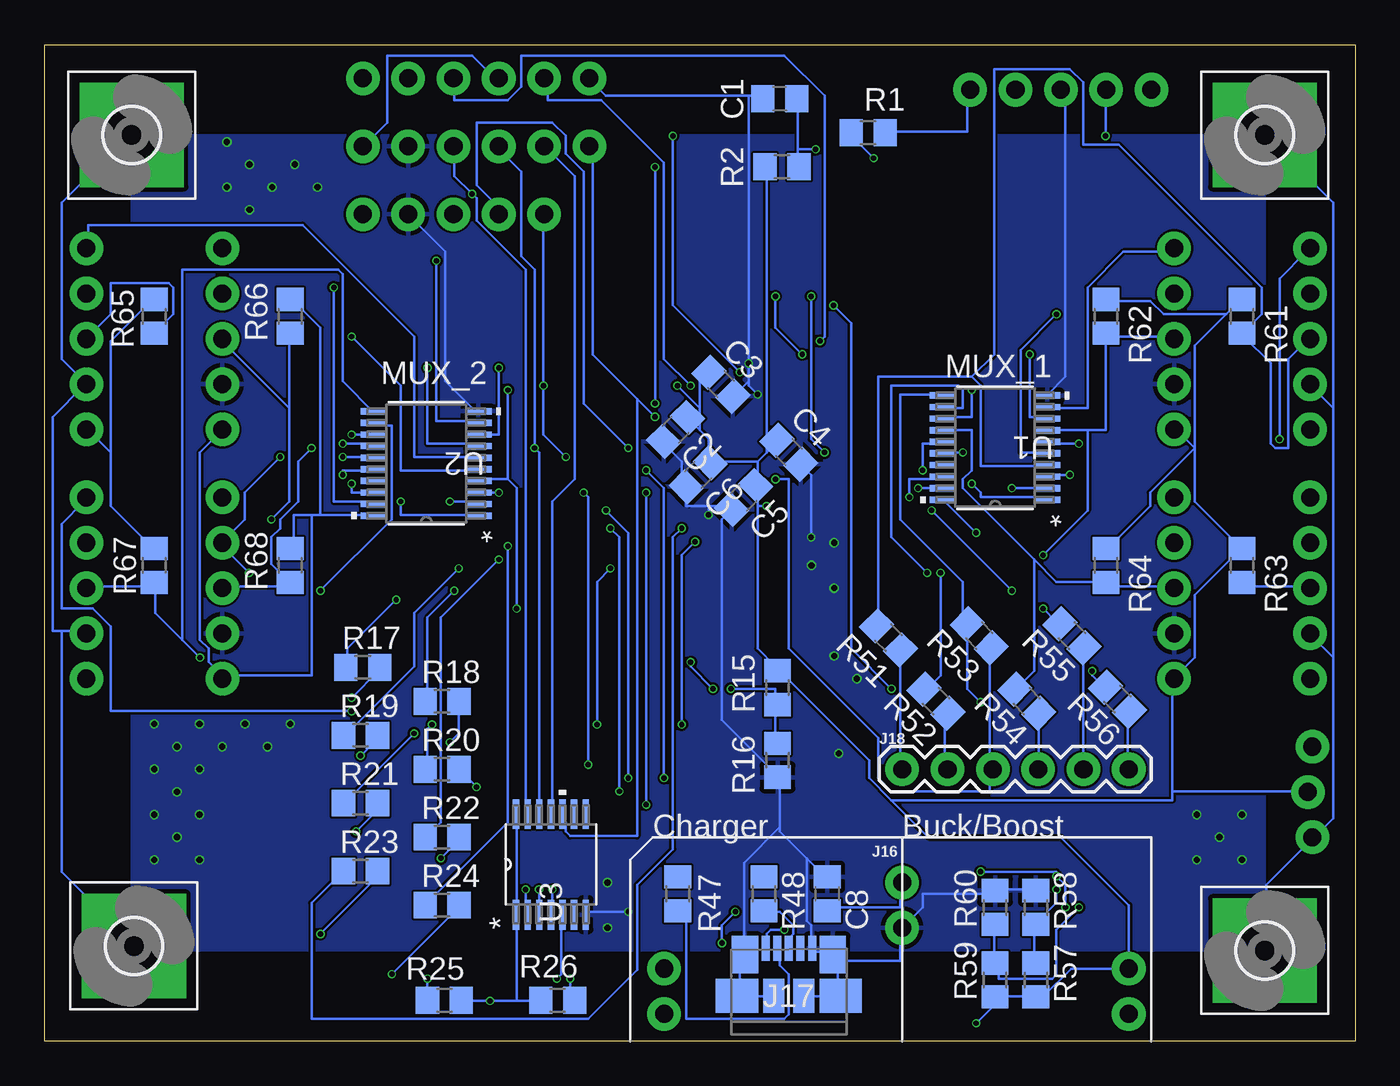
[diagram p3: board, bottom side, seen from below]

Size 73.46 x 55.87 mm. Coordinates in mm from the lower left corner, seen from the top.
Outline: 0,0 73.46,0 73.46,55.87 0,55.87 0,0
Copper layers (1*16): Top 0.035559375mm / dielectric 1.6mm / Bottom 0.035559375mm
Design rules "jlcpcb2layer": minimum track width 5mil, minimum drill 12mil, track to track 5mil, track to pad 5mil, pad to pad 5mil, via to via 5mil, smd to smd 5mil, copper to edge 8mil, drill to drill 6mil, minimum pad ring 5mil, minimum via ring 3mil, stop-mask expansion 2.5mil, vias tented up to drill 0mil, thermal gap 10mil

### Footprints (pad centres in the part's own frame; a part is rotated, then mirrored left to right if it is on the bottom)
C0805 = smd 1.3 x 1.5: 1 -0.95,0; 2 0.95,0
TCP_ROM = smd 1.167 x 1.092: 1 -0.674,0; 2 0.674,0
CHIP-LED0805 = smd 1.2 x 1.2: A 0,-1.05; C 0,1.05
3,0-PAD-SQUARE = drill 3 pad 5.842 square: B3,0 0,0
QFP50P1200X1200X120-64N = smd 1.475 x 0.3: 1 -5.738,3.75; 2 -5.738,3.25; 3 -5.738,2.75; 4 -5.738,2.25; 5 -5.738,1.75; 6 -5.738,1.25; 7 -5.738,0.75; 8 -5.738,0.25; 9 -5.738,-0.25; 10 -5.738,-0.75; 11 -5.738,-1.25; 12 -5.738,-1.75; 13 -5.738,-2.25; 14 -5.738,-2.75; 15 -5.738,-3.25; 16 -5.738,-3.75; 33 5.738,-3.75; 34 5.738,-3.25; 35 5.738,-2.75; 36 5.738,-2.25; 37 5.738,-1.75; 38 5.738,-1.25; 39 5.738,-0.75; 40 5.738,-0.25; 41 5.738,0.25; 42 5.738,0.75; 43 5.738,1.25; 44 5.738,1.75; 45 5.738,2.25; 46 5.738,2.75; 47 5.738,3.25; 48 5.738,3.75 | smd 0.3 x 1.475: 17 -3.75,-5.738; 18 -3.25,-5.738; 19 -2.75,-5.738; 20 -2.25,-5.738; 21 -1.75,-5.738; 22 -1.25,-5.738; 23 -0.75,-5.738; 24 -0.25,-5.738; 25 0.25,-5.738; 26 0.75,-5.738; 27 1.25,-5.738; 28 1.75,-5.738; 29 2.25,-5.738; 30 2.75,-5.738; 31 3.25,-5.738; 32 3.75,-5.738; 49 3.75,5.738; 50 3.25,5.738; 51 2.75,5.738; 52 2.25,5.738; 53 1.75,5.738; 54 1.25,5.738; 55 0.75,5.738; 56 0.25,5.738; 57 -0.25,5.738; 58 -0.75,5.738; 59 -1.25,5.738; 60 -1.75,5.738; 61 -2.25,5.738; 62 -2.75,5.738; 63 -3.25,5.738; 64 -3.75,5.738
1X05 = drill 1.016 pad 1.88: 1 0,0; 2 2.54,0; 3 5.08,0; 4 7.62,0; 5 10.16,0
SD_CARD = smd 0.7 x 1.75: 1 3.3,0; 2 2.2,0; 3 1.1,0; 4 0,0; 5 -1.1,0; 6 -2.2,0; 7 -3.3,0; 8 -4.4,0 | smd 1.3 x 1.5: 9 -5.6,0.125 | smd 1.5 x 1.5: 10 5.75,0.125 | smd 0.8 x 1.5: 11 -5.85,7.725 | smd 0.8 x 1.4: 13 6.1,8.375 | smd 1 x 1.55: CD_A 5.85,10.8 | smd 1.45 x 1: CD_B -5.525,9.225
1X06 = drill 1.016 pad 1.88: 1 0,0; 2 2.54,0; 3 5.08,0; 4 7.62,0; 5 10.16,0; 6 12.7,0
1X03_LOCK = drill 1.016 pad 1.88: 1 0,0.127; 2 2.54,-0.127; 3 5.08,0.127
1X02 = drill 1.016 pad 1.88: 1 0,0; 2 2.54,0
MICRO_USB = smd 1.38 x 0.45: 1 2.66,1.3; 2 2.66,0.65; 3 2.66,0; 4 2.66,-0.65; 5 2.66,-1.3 | smd 2.1 x 1.475: P1 2.3,-2.462; P2 2.3,2.462 | smd 1.9 x 2.375: P3 0,2.913; P4 0,-2.913 | smd 1.9 x 1.175: P5 0,0.838; P6 0,-0.838
R0805 = smd 1.3 x 1.5: 1 -0.95,0; 2 0.95,0
TACTILE_SWITCH_TALL = smd 1.55 x 1.3: A1 -3.975,-2.25; A2 3.975,-2.25; B1 -3.975,2.25; B2 3.975,2.25
SOT360-1_NXP = smd 1.473 x 0.356: 1 -2.921,2.925; 2 -2.921,2.275; 3 -2.921,1.625; 4 -2.921,0.975; 5 -2.921,0.325; 6 -2.921,-0.325; 7 -2.921,-0.975; 8 -2.921,-1.625; 9 -2.921,-2.275; 10 -2.921,-2.925; 11 2.921,-2.925; 12 2.921,-2.275; 13 2.921,-1.625; 14 2.921,-0.975; 15 2.921,-0.325; 16 2.921,0.325; 17 2.921,0.975; 18 2.921,1.625; 19 2.921,2.275; 20 2.921,2.925
PW14 = smd 1.676 x 0.356: 1 -2.819,1.95; 2 -2.819,1.3; 3 -2.819,0.65; 4 -2.819,0; 5 -2.819,-0.65; 6 -2.819,-1.3; 7 -2.819,-1.95; 8 2.819,-1.95; 9 2.819,-1.3; 10 2.819,-0.65; 11 2.819,0; 12 2.819,0.65; 13 2.819,1.3; 14 2.819,1.95
SON_B1-APUR_STM = smd 0.813 x 0.254: 1 -1.473,1; 2 -1.473,0.5; 3 -1.473,0; 4 -1.473,-0.5; 5 -1.473,-1; 6 1.473,-1; 7 1.473,-0.5; 8 1.473,0; 9 1.473,0.5; 10 1.473,1 | smd 1.753 x 2.489: 11 0,0
SOT-23-5_MC_MCH = smd 1.321 x 0.508: 1 -1.295,0.95; 2 -1.295,0; 3 -1.295,-0.95; 4 1.295,-0.95; 5 1.295,0.95
PQFN50P300X300X100-16N = smd 0.53 x 0.35: 1 -1.22,1; 2 -1.22,0.5; 3 -1.22,0; 4 -1.22,-0.5; 5 -1.22,-1; 9 1.22,-1; 10 1.22,-0.5; 11 1.22,0; 12 1.22,0.5; 13 1.22,1 | smd 0.35 x 0.53: 6 -0.5,-1.22; 7 0,-1.22; 8 0.5,-1.22; 14 0.5,1.22; 15 0,1.22; 16 -0.5,1.22
IND_4028_TDK = smd 1.6 x 3.9: 1 -1.45,0; 2 1.45,0

### Placement (x,y rotation side)
C1  32.26,52.83 180 bottom
C2  38.1,34.29 225 bottom
C3  35.56,36.83 315 bottom
C4  31.75,33.02 315 bottom
C5  34.29,30.48 225 bottom
C6  36.83,31.75 225 bottom
C7  31.75,4.45 0 top
C8  29.59,8.26 90 bottom
C9  22.48,7.75 270 top
C10  22.35,2.79 90 top
C11  45.34,30.99 45 top
D1  61.98,14.61 270 top
D2  61.98,12.7 270 top
D3  61.98,10.79 270 top
D4  61.98,8.89 270 top
D5  61.98,6.99 270 top
D6  61.98,5.08 270 top
D7  61.98,3.17 270 top
D8  61.98,1.27 270 top
D9  31.75,2.29 270 top
H1  5.08,50.8 0 bottom
H2  68.58,50.8 0 bottom
H3  5.08,5.08 0 bottom
H4  68.45,5.33 0 bottom
IC1  35.56,33.02 225 top
J1  55.63,46.35 180 top
J2  2.54,34.29 90 top
J3  48.51,4.83 0 top
J4  55.63,50.16 180 top
J5  10.16,34.29 90 top
J6  2.54,20.32 90 top
J7  10.16,20.32 90 top
J8  71.12,34.29 90 top
J9  63.5,34.29 90 top
J10  71.12,20.32 90 top
J11  63.5,20.32 90 top
J12  21.59,53.34 180 top
J13  2.54,11.43 90 top
J14  42.93,53.98 0 top
J15  38.73,1.52 90 top
J16  25.4,6.35 90 top
J17  31.75,2.54 90 bottom
J18  25.4,15.24 0 bottom
J19  12.7,1.52 90 top
R1  27.3,50.93 180 bottom
R2  32.13,49.02 0 bottom
R3  22.61,35.05 270 top
R4  22.61,30.99 90 top
R5  20.32,35.05 270 top
R6  20.32,30.99 90 top
R7  18.03,35.05 270 top
R8  18.03,30.99 90 top
R9  54.61,34.67 270 top
R10  54.61,30.48 90 top
R11  52.07,34.67 270 top
R12  52.07,30.48 90 top
R13  49.53,34.67 270 top
R14  49.53,30.48 90 top
R15  32.38,19.81 270 bottom
R16  32.38,15.75 90 bottom
R17  55.63,20.95 180 bottom
R18  51.18,19.05 180 bottom
R19  55.75,17.14 180 bottom
R20  51.18,15.24 180 bottom
R21  55.75,13.34 180 bottom
R22  51.18,11.43 180 bottom
R23  55.75,9.53 180 bottom
R24  51.18,7.62 180 bottom
R25  51.05,2.29 180 bottom
R26  44.7,2.29 0 bottom
R27  48.01,42.55 90 top
R28  45.47,42.55 90 top
R29  6.35,38.1 90 top
R30  6.35,43.18 90 top
R31  13.97,38.1 90 top
R32  13.97,43.18 90 top
R33  6.35,24.13 90 top
R34  6.35,29.21 90 top
R35  13.97,24.13 90 top
R36  13.97,29.21 90 top
R37  67.31,38.1 90 top
R38  67.31,43.18 90 top
R39  59.69,38.1 90 top
R40  59.69,43.18 90 top
R41  67.31,24.13 90 top
R42  67.31,29.21 90 top
R43  59.69,24.13 90 top
R44  59.69,29.21 90 top
R45  35.05,3.43 90 top
R46  35.94,7.87 270 top
R47  37.97,8.26 90 bottom
R48  33.15,8.26 90 bottom
R49  19.05,1.65 0 top
R50  19.05,3.81 180 top
R51  26.16,22.61 135 bottom
R52  23.5,19.05 135 bottom
R53  21.08,22.73 135 bottom
R54  18.41,19.05 135 bottom
R55  15.88,22.73 135 bottom
R56  13.34,19.18 135 bottom
R57  17.91,3.43 90 bottom
R58  17.91,7.49 270 bottom
R59  20.19,3.43 90 bottom
R60  20.19,7.49 270 bottom
R61  6.35,40.64 270 bottom
R62  13.97,40.64 270 bottom
R63  6.35,26.67 270 bottom
R64  13.97,26.67 270 bottom
R65  67.31,40.64 270 bottom
R66  59.69,40.64 270 bottom
R67  67.31,26.67 270 bottom
R68  59.69,26.67 270 bottom
S1  29.84,50.93 180 top
U1  20.19,33.27 180 bottom
U2  52.07,32.38 180 bottom
U3  45.09,9.91 90 bottom
U4  19.05,7.62 180 top
U5  31.75,7.62 270 top
U8  35.56,17.78 180 top
U$1  13.59,7.75 90 top

### Tracks (layer width: path | path; a pad name or v marks a point on that pad's centre or on a via)
!MCLR  (via drill 0.3)
  Top 0.127: v39.25,35.75 40,36.5 IC1.7 | v39.25,49 36,52.25 22.75,52.25 21.75,53.25 J12.1
  Bottom 0.127: v39.25,49 v39.25,35.75 | R1.1 26.25,51 21.75,51 21.75,53.25 J12.1
!MUX1_INT0
  Bottom 0.127: J2.3 2.75,39.25 3.75,38.25 3.75,33.25 4.5,33.25 4.75,33.5 4.75,38 6.25,39.5 R61.2 6.25,39.75 5.25,40.75 5.25,42.25 13.25,50.25 15.25,50.25 15.25,53.75 16,54.5 20.25,54.5 20.25,38.5 21.5,37.25 | 21.5,37.25 21,36.75 21,32.25 17.5,32.25 U1.4 | 21.5,37.25 26.75,37.25 26.75,23.5 R51.2
!MUX1_INT1  (via drill 0.3)
  Top 0.127: v23.25,26.25 22.25,27.25 v17.5,27.25
  Bottom 0.127: 15,34.25 14,34.25 14,39.5 R62.2 13.75,39.5 10.25,39.5 J5.3 | 15,34.25 17.25,34.25 U1.7 | v23.25,26.25 23.25,20.5 24,19.75 R52.2 | v17.5,27.25 15,29.75 15,34.25
!MUX1_INT2  (via drill 0.3)
  Top 0.127: v21,19 1.25,19 1.25,24 2.5,25.25 J6.3
  Bottom 0.127: R63.2 6.25,25.5 2.75,25.5 J6.3 | U1.11 23.25,36.25 25.5,36.25 25.5,29.25 22,25.75 22,23.5 R53.2 21.75,23.25 21.75,19.75 v21,19
!MUX1_INT3
  Bottom 0.127: 18,27 16.75,25.75 14,25.75 R64.2 13.75,25.5 10.25,25.5 J7.3 | 18,27 22,31 22,31.5 21.5,32 21.5,34.25 23,34.25 U1.14 | 18,27 18,20.75 19,19.75 R54.2
!MUX2_INT0  (via drill 0.3)
  Top 0.127: v47.5,36.5 58.5,36.5 58.75,36.25 61.25,36.25 63,38 69.75,38 J8.3 | v47,24.25 v17.5,24.25
  Bottom 0.127: 47.5,31.5 49,31.5 U2.4 | v47.5,36.5 47.5,31.5 | v17.5,24.25 16.75,23.5 R55.2 | v47,24.25 47,31 47.5,31.5 | R65.2 66.25,40.75 66.25,42.25 66.5,42.5 69.75,42.5 69.75,40.75 71,39.5 J8.3
!MUX2_INT1  (via drill 0.3)
  Top 0.127: v52,37.75 52.25,38 62.25,38 63.5,39.25 J9.3 | v14.75,20.75 17.75,23.75 53.5,23.75 59,29.25 v60.75,29.25
  Bottom 0.127: v52,37.75 52,33.5 49.25,33.5 U2.7 | v14.75,20.75 14.75,20.5 14.25,20 R56.2 | v60.75,29.25 59.75,30.25 59.75,35.5 | 59.75,35.5 59.75,39.5 R66.2 | 59.75,35.5 63.5,39.25 J9.3
!MUX2_INT2  (via drill 0.3)
  Top 0.127: v64.75,21.5 63,21.5 62.25,20.75 33.25,20.75 33.25,18.25 33.75,17.75 34.25,17.75 U8.11
  Bottom 0.127: 65.75,22.5 67.25,24 67.25,25.5 R67.2 67.5,25.5 71,25.5 J10.3 | 65.75,22.5 v64.75,21.5 | 65.75,22.5 65.75,43.25 57,43.25 56.75,43 56.75,37 55,35.25 U2.11
!MUX2_INT3  (via drill 0.3)
  Top 0.127: v56.75,33.5 57,33.25 v58.5,33.25
  Bottom 0.127: v56.75,33.5 55,33.5 U2.14 | v58.5,33.25 59.25,32.5 59.25,30.25 60.25,29.25 60.25,28.75 60.75,28.25 60.75,26.75 59.75,25.75 R68.2 59.75,25.5 63.5,25.5 J11.3
!SS  (via drill 0.3)
  Top 0.127: v49.5,47.5 44.25,47.5 44.25,46.25 37.5,39.5 IC1.15
  Bottom 0.127: J4.3 50.5,50 50.5,48.5 v49.5,47.5 49.25,47.25 49.25,46 46.5,43.25 46.5,12.75 U3.13
!TOF_INT1  (via drill 0.3)
  Top 0.127: v43.25,30.75 42.5,31.5 IC1.64 | v43,15.5 42.75,15.25 25.5,15.25 J18.1
  Bottom 0.127: v43.25,30.75 43,30.5 v43,15.5 | R51.1 25.5,21.75 25.5,15.25 J18.1
!TOF_INT2  (via drill 0.3)
  Top 0.127: v39.75,32 41.25,32 41.75,31.5 IC1.63 | v38.75,14.75 38.25,14.25 26.25,14.25 26,14 24,14 23,15 J18.2
  Bottom 0.127: v39.75,32 38.75,31 v38.75,14.75 | R52.1 23,18.25 23,15.25 J18.2
!TOF_INT3  (via drill 0.3)
  Top 0.127: v32.5,31.5 41,31.5 41.5,31 IC1.62
  Bottom 0.127: v32.5,31.5 31.75,31.5 31.75,22 26.75,17 26.75,14.75 26,14 20.5,14 20.5,15 J18.3 20.5,15.25 20.5,22 R53.1
!TOF_INT4  (via drill 0.3)
  Top 0.127: v42,29.75 41.25,30.5 IC1.61 | v40.75,14.75 39.75,13.75 26.25,13.75 26,13.5 19.5,13.5 18,15 J18.4
  Bottom 0.127: v42,29.75 40.75,28.5 v40.75,14.75 | R54.1 17.75,18.25 17.75,15.25 J18.4
!TOF_INT5  (via drill 0.3)
  Top 0.127: v39.75,30.75 40.25,30.75 40.75,30.25 IC1.60 | v39.75,13.25 39.5,13 17.25,13 15.25,15 J18.5
  Bottom 0.127: v39.75,13.25 v39.75,30.75 | R55.1 15.25,22 J18.5
!TOF_INT6  (via drill 0.3)
  Top 0.127: v41.75,28.75 40.75,29.75 IC1.59 | v41.25,14 39.75,12.5 15.25,12.5 12.75,15 J18.6
  Bottom 0.127: v41.75,28.75 41.25,28.25 v41.25,14 | R56.1 12.75,18.5 12.75,15.25 J18.6
!U1RTS  (via drill 0.3)
  Top 0.127: v31,38.5 31.25,38.5 32,37.75 IC1.23 | v32.5,41.75 38.75,48 50,48 51.75,49.75 51.75,52.25 54,52.25 55.5,53.75 J14.6
  Bottom 0.127: v31,38.5 32.5,40 v32.5,41.75
+3V3  (via drill 0.3)
  Top 0.127: J11.1 63.5,20.5 71,20.5 J10.1 | R44.1 59.75,28.5 60,28.75 62.5,28.75 63,29.25 66.5,29.25 67.25,28.5 R42.1 67.5,28.5 68.25,29.25 72.5,29.25 | R43.1 59.75,23.25 60.5,24 66.5,24 67.25,23.25 R41.1 67.5,23.25 69.75,25.5 69.75,26 70,26 70.75,26.75 71.75,26.75 72.5,27.5 72.5,29.25 | 72.5,34.5 72.5,37.25 71.75,38 70.5,38 70,37.5 67.75,37.5 67.5,37.25 R37.1 | 72.5,34.5 71.25,34.5 J8.1 71,34.25 63.5,34.25 J9.1 63.5,34.5 62.5,35.5 54.75,35.5 R9.1 54.5,35.75 52.25,35.75 R11.1 52,35.75 49.75,35.75 R13.1 49.5,35.75 49.25,36 47.25,36 47,36.25 47,38 | 72.5,34.5 72.5,29.25 | J4.1 55.75,50 55.75,46.5 J1.1 55.75,46.25 56.25,45.75 64,45.75 67.5,42.25 R38.1 67.25,42.25 66.25,43.25 60.75,43.25 59.75,42.25 R40.1 59.5,42 59.25,41.75 48.25,41.75 R27.1 48,41.75 45.5,41.75 R28.1 45.25,41.5 43.5,41.5 | 43.5,41.5 43,41.5 39.25,37.75 IC1.10 39,37.5 38.25,36.75 v38,36.75 | 43.5,41.5 47,38 | 47,38 47.75,37.25 59.5,37.25 R39.1 | v21.25,28.5 14,28.5 R36.1 13.75,28.5 13,29.25 7.5,29.25 | 7.25,29.25 6.5,28.5 R34.1 | 7.5,29.25 7.25,29.25 | R29.1 5.5,38 2,38 0.75,36.75 0.75,29.25 7.25,29.25 | 9,43.25 12.75,43.25 13.75,42.25 R32.1 14,42 14.25,41.75 17,41.75 22.5,36.25 R3.1 | 9,43.25 7.5,43.25 6.5,42.25 R30.1 | 9,43.25 9,52.75 10.75,54.5 15.25,54.5 15.25,53 16.25,52 17.75,52 19,53.25 J12.2 | 27.25,37.25 23.75,37.25 22.75,36.25 R3.1 | 27.25,37.25 30.25,37.25 30.75,36.75 IC1.26 | 27.25,37.25 29.75,39.75 32.75,39.75 33.25,39.25 IC1.19 | R3.1 22.5,36 20.5,36 R5.1 20.25,36 18.25,36 R7.1 18,36.25 14.75,36.25 14,37 R31.1 13.75,37 11.25,34.5 10.25,34.5 J5.1 10,34.25 3,34.25 | 3,34.25 2.75,34.25 J2.1 3,34.25
  Top 0.127: 7.5,29.25 7.5,33.25 4,33.25 3,34.25 | 33,30.5 38.5,30.5 39.75,29.25 IC1.57 | 33,30.5 31.25,30.5 30.75,30 IC1.38 | v33,30 33,30.5 | v48.5,2.25 48.5,2.5 | 48.5,2.5 48.5,4.75 J3.4 | R33.1 6.5,23.25 7.25,24 13,24 13.75,23.25 R35.1 14,23 14,20.25 | U4.1 20.75,6.5 22.5,4.75 23.25,4.75 23.5,4.5 23.5,2 22.5,2 C10.1 22.25,1.75 21.25,1.75 | 21.25,1.75 20,1.75 R49.2 | 35.25,16.5 35.5,16.5 U8.15 | 35.25,16.5 35,16.5 | 36.75,16 36.75,16.75 U8.1 | 36.75,16 35.75,16 35.25,16.5 | 35,16.5 34.25,15.75 30.75,15.75 26.25,20.25 14,20.25 | 14,20.25 10.25,20.25 J7.1 10,20.5 2.75,20.5 J6.1 | 35,16.5 U8.14 | v21.25,1 21.25,1.75 | 48.5,2.5 52.5,2.5 53,3 53,9.75 49.5,9.75 43.25,16 36.75,16
  Bottom 0.127: 58.5,29.5 59.5,29.5 59.5,27.75 R68.1 | 58.5,29.5 58,29.5 | 58,29.5 55,29.5 U2.20 | 58,29.5 58,40 59.5,41.5 R66.1 | 63.5,20.5 58.5,20.5 58.5,29.5 | 69.75,33 69.75,30 67.5,27.75 R67.1 | 69.75,33 71,34.25 J8.1 | 69.75,33 69.75,39.25 67.5,41.5 R65.1 | J14.3 48.25,54 49.5,55.25 54.25,55.25 54.25,51.5 55.5,50.25 J4.1 | 63.5,20.5 64.25,21.25 64.25,22 64.75,22.5 64.75,33 63.5,34.25 J9.1 | 63.5,20.5 J11.1 | v21.25,28.5 23,30.25 U1.20 | 9,33.25 9,30.25 6.5,27.75 R63.1 6.5,27.5 9,25 9,21.5 10,20.5 J7.1 10.25,20.25 10.25,14 | 9,33.25 10,34.25 J5.1 | 9,33.25 11.5,30.75 11.5,30 13.75,27.75 R64.1 | 7.25,40.75 9,39 9,33.25 | 7.25,40.75 6.5,41.5 R61.1 | 7.25,40.75 10.75,40.75 11.5,41.5 13.75,41.5 R62.1 | 33.5,30 33.5,31 C5.1 33.5,31.25 33.5,32.5 | 33.5,30 33.5,22 32.5,21 R15.1 32.25,20.75 27.25,15.75 27.25,14.75 26,13.5 | 33.5,32.5 33,33 | 33,33 32.5,33.5 C4.1 | 33,33 33,49 R2.1 | 33.5,32.5 36,32.5 C6.1 36.25,32.5 36.25,33.75 36.75,34.25 | 36.75,34.25 37.25,34.75 C2.1 | 36.75,34.25 36.75,35.5 | 36.75,35.5 36.75,37 36.25,37.5 C3.1 | 33.5,30 v33,30 | 47,2.25 v48.5,2.25 50,2.25 R25.1 | 47,2.25 45.75,2.25 R26.1 | 47,2.25 47,7 U3.1 47,7.25 47,12.5 U3.14 | 10.25,14 10.25,13.5 26,13.5 | 10.25,14 2.75,14 J13.2 | v21.25,1 20.25,2 20.25,2.25 R59.1 20,2.5 18,2.5 R57.1 17.45,2.54 15.93,4.06 J19.2 12.7,7.62 16.51,11.43 23.93,11.43 26,13.5 | 36.75,35.5 v38,36.75
ACCEL_A0  (via drill 0.3)
  Top 0.127: v35,19.75 35.5,19.75 35.5,19 U8.7
  Bottom 0.127: v35,19.75 32.5,19.75 32.5,19 R15.2 32.5,18.75 32.5,16.75 R16.2
BB_EN  (via drill 0.3)
  Top 0.127: v16.75,8.5 17.5,8.5 U4.6
  Bottom 0.127: v16.75,8.5 16.75,7.75 17.75,6.75 R58.2 18,6.5 18,4.5 R57.2
BB_M/S  (via drill 0.3)
  Top 0.127: v15.5,7.5 16,8 17.5,8 U4.7
  Bottom 0.127: v15.5,7.5 16.75,6.25 16.75,3.75 17,3.5 20,3.5 20,4.25 R59.2 20.25,4.5 20.25,6.5 R60.2
GND  (via drill 0.3, 0.35)
  Top 0.127: D8.C 63,1.5 63,3 D7.C 63,3.25 63,5 D6.C | D6.C 63,5.25 63,6.75 D5.C 63,7 63,8.75 D4.C 63,9 63,10.75 D3.C 63,11 63,12.5 D2.C 63,12.75 63,14.5 D1.C 63,14.75 58,19.75 36.75,19.75 | 34.5,17.25 34.5,16.75 U8.13 | 34.5,17.25 35.75,17.25 | 35.75,17.25 36,17.25 36,16.75 U8.16 | 34.5,17.25 U8.12 | 35.75,17.25 34.75,18.25 34.5,18.25 U8.10 34.25,18.25 33.75,18.25 33.75,19.25 34.75,20.25 36.75,20.25 36.75,19.75 | 36.75,19.75 36.75,18.75 U8.5 | H4.B3,0 68.25,5.25 63.25,5.25 D6.C | J11.2 63.5,22.75 64,22.25 70.5,22.25 71,22.75 J10.2 | J9.2 63.5,36.75 64,36.25 70.5,36.25 71,36.75 J8.2 | J1.2 53.25,46.5 53.25,50 J4.2 53.25,50.25 54.5,51.5 57,51.5 | 57,51.5 68,51.5 68.5,51 H2.B3,0 | IC1.25 31.5,36.75 32,36.25 v33.5,36.25 38.25,36.25 39.25,37.25 IC1.9 39.5,37.5 39.75,37.75 42.25,37.75 46.5,33.5 46.5,31.5 | R10.1 54.5,29.75 52.25,29.75 R12.1 52,29.75 49.75,29.75 R14.1 49.5,29.75 48.25,29.75 46.5,31.5 | 46.5,31.5 46,31.5 C11.2 46.5,31.5 | v34,38 33.75,38 33.25,38.5 IC1.20 | 24.75,54.25 24.5,54.5 17.75,54.5 17,53.75 | 24.75,54.25 25.75,53.25 S1.A2 | 17,53.75 16.75,53.5 J12.3 17,53.75 | 17,53.75 15.75,55 9.25,55 5.25,51 H1.B3,0 | 24.75,54.25 42.5,54.25 42.75,54 J14.1 43,54 44.25,55.25 57,55.25 57,51.5 | 37,7.25 37,8.75 36,8.75 R46.1 35.75,9 34.75,10 31.75,10 U5.2 31.75,7.25 26.25,7.25 25.5,6.5 J16.1 25.25,6.5 24,6.5 | 37,7.25 37,6.25 36.75,6 34.25,6 32.75,4.5 C7.2 | 37,7.25 40,7.25 | 40,7.25 v40.75,7.25 46.25,7.25 46.25,5 J3.6 | 40,7.25 40,3 38.75,1.75 J15.1 | 24,6.5 22.75,6.5 22.5,6.75 C9.2 | R8.1 18.25,30.25 20.25,30.25 R6.1 20.5,30.25 22.5,30.25 R4.1 22.75,30 24.5,28.25 v30.5,28.25 31,28.25 31.5,28.75 IC1.41 31.75,29 32.25,29.5 v36.25,29.5
  Top 0.127: J2.2 2.75,36.75 3.25,36.25 9.5,36.25 10,36.75 J5.2 | J6.2 2.75,22.75 3.25,22.25 9.5,22.25 10,22.75 J7.2 | 20,3.75 22.25,3.75 C10.2 | 18.75,7.25 18,7.25 17.87,7.12 U4.9 | 18.75,7.25 19,7.5 U4.11 | U4.3 20.5,7.5 19.25,7.5 U4.11 | 18.75,7.25 19.75,6.25 20,6.25 R50.1 20,3.75 | 18.75,7.25 U4.11 | 24,6.5 24,0.5 19.25,0.5 | 19.25,0.5 19,0.75 19,3.75 20,3.75 | J19.1 13.72,0.5 19.25,0.5
  Bottom 0.127: 72.5,23 73,23 73,35 71.25,36.75 J8.2 71.25,37 72.5,38.25 72.5,47 68.75,50.75 H2.B3,0 | 72.5,23 71.25,23 J10.2 | U2.10 49.25,35.25 51,37 51,44.25 53,46.25 J1.2 | 72.5,23 72.5,9.5 68.5,5.5 H4.B3,0 | 34,37 v34,38 34,53 | 34,37 34.75,36.25 C3.2 | 34,53 42,53 42.75,53.75 J14.1 | 34,53 33.25,53 C1.2 | v33.5,36.25 34,36.75 34,37 | U1.10 17.25,36.25 16.25,37.25 16.25,53 16.5,53.25 J12.3 | v40.75,7.25 43,7.25 U3.7 | J17.P1 29.5,5 30.25,5 J17.5 30.5,5.25 30.5,6.5 30.75,6.75 30.75,10.25 | J17.P6 30.75,2.5 29,2.5 J17.P4 29,2.75 29,4.5 | 29,4.5 29.25,4.75 J17.P1 | R58.1 18,8.5 20,8.5 R60.1 20.25,8.25 24.25,8.25 24.25,7.5 J16.1 25.5,6.25 25.5,4.5 29,4.5 | 29,4.5 J17.P1 | v30.5,28.25 30.5,31.75 31,32.25 C4.2 | 36.25,30 37.5,30 37.5,31 C6.2 37.75,31.25 37.75,32.5 38.75,33.5 C2.2 | 36.25,30 35,30 C5.2 35,29.75 35.5,29.25 35.5,18 32.5,15 R16.1 32.25,14.75 32.25,12 | J17.P5 32.75,2.5 34.5,2.5 J17.P3 34.5,2.75 34.5,4.5 34.25,4.75 J17.P2 34.25,5 34.25,10 32.25,12 | 30.75,10.25 32.25,11.75 32.25,12 | 30.75,10.25 29.75,9.25 C8.2 | 36.25,30 v36.25,29.5 | H3.B3,0 5,5.25 5,8.75 2.5,11.25 J13.1 2.25,11.5 1.25,12.5 1.25,21.5 | 1.25,21.5 2.5,22.75 J6.2 | 1.25,35.5 2.5,36.75 J2.2 | 1.25,21.5 1.25,35.5 | 1.25,35.5 1.25,47 5,50.75 H1.B3,0
  other vias: 67.31,10.16 66.04,11.43 64.77,12.7 66.04,13.97 67.31,15.24 66.04,16.51 64.77,17.78 67.31,17.78 64.77,15.24 67.31,12.7 64.77,10.16 63.5,16.51 62.23,17.78 60.96,16.51 59.69,17.78 41.91,6.35 41.91,8.89 29.21,25.4 30.48,26.67 29.21,27.94 6.35,10.16 7.62,11.43 8.89,12.7 6.35,12.7 8.89,10.16 29.21,21.59 27.94,20.32 28.96,16.13 63.25,50.42 61.98,49.15 60.71,47.88 63.25,47.88 61.98,46.61 59.44,49.15 58.17,47.88
  pour Top: 5.08,5.08 5.08,50.8 68.58,50.8 68.58,5.08
  pour Bottom: 5.08,5.08 5.08,50.8 68.58,50.8 68.58,5.08
I2C_MUX1_A0  (via drill 0.3)
  Top 0.127: v21.5,31.25 22,31.75 22.5,31.75 R4.2 22.75,32 22.75,34 R3.2
  Bottom 0.127: v21.5,31.25 21,30.75 21,30.5 17.5,30.5 U1.1
I2C_MUX1_A1  (via drill 0.3)
  Top 0.127: v19.25,31 20,31.75 20.25,31.75 R6.2 20.5,32 20.5,34 R5.2
  Bottom 0.127: v19.25,31 17.5,31 U1.2
I2C_MUX1_A2  (via drill 0.3)
  Top 0.127: v16,31.75 18,31.75 R8.2 18.25,32 18.25,34 R7.2
  Bottom 0.127: v16,31.75 17.25,31.75 U1.3
I2C_MUX2_A0  (via drill 0.3)
  Top 0.127: v53.5,30.25 54.5,31.25 R10.2 54.75,31.5 54.75,33.5 R9.2
  Bottom 0.127: v53.5,30.25 53.5,29.5 49.25,29.5 U2.1
I2C_MUX2_A1  (via drill 0.3)
  Top 0.127: v50.75,30.25 51.75,31.25 52,31.25 R12.2 52.25,31.5 52.25,33.5 R11.2
  Bottom 0.127: v50.75,30.25 49.25,30.25 U2.2
I2C_MUX2_A2  (via drill 0.3)
  Top 0.127: v48,30.75 48.5,31.25 49.5,31.25 R14.2 49.75,31.5 49.75,33.5 R13.2
  Bottom 0.127: v48,30.75 49,30.75 U2.3
LED0  (via drill 0.3)
  Top 0.127: v53.75,24.75 35.75,24.75 34.25,26.25 IC1.48
  Bottom 0.127: v53.75,24.75 56.5,22 56.5,21 R17.2
LED1  (via drill 0.3)
  Top 0.127: v50.5,25.25 38,25.25 37,26.25 IC1.49
  Bottom 0.127: v50.5,25.25 52,23.75 52,19.25 R18.2
LED2  (via drill 0.3)
  Top 0.127: v50.25,26.5 47.75,26.5 47.25,26 38,26 37.5,26.5 IC1.50
  Bottom 0.127: v50.25,26.5 52.75,24 52.75,21 56.5,17.25 R19.2
LED3  (via drill 0.3)
  Top 0.127: v41.75,26.5 38.25,26.5 37.75,27 IC1.51 | v51.75,17.75 v42.5,17.75
  Bottom 0.127: v41.75,26.5 42.5,25.75 v42.5,17.75 | v51.75,17.75 52,17.5 52,15.25 R20.2
LED4  (via drill 0.3)
  Top 0.127: v37,28 37.5,28 38,27.5 IC1.52 | v37.75,17.75 38.25,17.25 v52.75,17.25
  Bottom 0.127: v37,28 37.75,27.25 v37.75,17.75 | v52.75,17.25 56.5,13.5 R21.2
LED5  (via drill 0.3)
  Top 0.127: v48,27 39,27 38.5,27.5 IC1.53
  Bottom 0.127: v48,27 51.25,23.75 51.25,12.25 52,11.5 R22.2
LED6  (via drill 0.3)
  Top 0.127: v37.75,28.75 38,28.75 38.5,28.25 IC1.54
  Bottom 0.127: v37.75,28.75 38.25,28.25 38.25,10.75 40.25,8.75 40.25,4 43,1.25 58.5,1.25 58.5,7.75 56.75,9.5 R23.2
LED7  (via drill 0.3)
  Top 0.127: v47.5,27.75 39.75,27.75 39.25,28.25 IC1.55
  Bottom 0.127: v47.5,27.75 47.5,12.25 52,7.75 R24.2
MISO  (via drill 0.3)
  Top 0.127: v39.25,35 31.5,35 30,33.5 29,33.5 29,31.75 IC1.33
  Bottom 0.127: 40.25,36 42.75,38.5 42.75,50 J4.6 | 40.25,36 v39.25,35 | 40.25,36 40.25,11.5 44,11.5 44.25,11.75 44.25,12.25 44.5,12.5 U3.10
MOSI  (via drill 0.3)
  Top 0.127: v29.75,33 29.75,32 29.25,31.5 IC1.34 | v30.5,41.75 37.25,48.5 43.75,48.5 45.25,50 J4.5
  Bottom 0.127: v29.75,33 30.5,33.75 v30.5,41.75 | U3.11 45,12.75 45,30.25 43.75,31.5 43.75,48.5 45.25,50 J4.5
MUX1_SC0  (via drill 0.3)
  Top 0.127: v15.5,33.5 15,33 8.25,33 7.5,33.75 v4.25,33.75 | R30.2 6.25,44.25 2.75,44.25 J2.5
  Bottom 0.127: v15.5,33.5 17.25,33.5 U1.6 | v4.25,33.75 4.25,42.75 2.75,44.25 J2.5
MUX1_SC1
  Top 0.127: R32.2 13.75,44.25 10.25,44.25 J5.5
  Bottom 0.127: U1.9 17.25,35.5 15,35.5 15,42.25 13,44.25 10.25,44.25 J5.5
MUX1_SC2  (via drill 0.3)
  Top 0.127: v21.5,36.5 20,38 13,38 10.5,35.5 2,35.5 1.25,34.75 1.25,30.5 2.5,30.5 J6.5 2.75,30.25 6.25,30.25 R34.2
  Bottom 0.127: v21.5,36.5 21.5,35 23,35 U1.13
MUX1_SC3  (via drill 0.3)
  Top 0.127: v22,33 21.5,33.5 21.5,35 17.25,35 16,33.75 16,32.25 15.75,32.25 13.75,30.25 | 13.75,30.25 10.25,30.25 J7.5 | 13.75,30.25 R36.2
  Bottom 0.127: v22,33 23,33 U1.16
MUX1_SD0  (via drill 0.3)
  Top 0.127: v16.75,40.75 8,40.75 6.5,39.25 R29.2 6.25,39.25 5.25,39.25 2.75,41.75 J2.4
  Bottom 0.127: v16.75,40.75 18.75,38.75 18.75,33 17.5,33 U1.5
MUX1_SD1  (via drill 0.3)
  Top 0.127: 17.75,39 v18.25,38.5 | 17.75,39 14,39 R31.2 | 17.75,39 17.75,40.5 17,41.25 10.75,41.25 10.25,41.75 J5.4
  Bottom 0.127: v18.25,38.5 18.25,35 17.5,35 U1.8
MUX1_SD2  (via drill 0.3)
  Top 0.127: v24,26.25 23.5,25.75 15,25.75 14,26.75 8,26.75 6.5,25.25 R33.2 6.25,25.25 5.25,25.25 2.75,27.75 J6.4
  Bottom 0.127: v24,26.25 26,28.25 26,36.75 22.25,36.75 22,36.5 22,35.5 23,35.5 U1.12
MUX1_SD3  (via drill 0.3)
  Top 0.127: v24.25,32 24.25,31.5 23.75,31 v23.75,29.75 | R35.2 14,25.25 v19.25,25.25 24.5,25.25 24.5,26.5 23.25,27.75 17.25,27.75 16.75,27.25 10.75,27.25 10.25,27.75 J7.4
  Bottom 0.127: v24.25,32 24.25,33.5 23.25,33.5 U1.15 | v19.25,25.25 v23.75,29.75
MUX2_SC0
  Top 0.127: R38.2 67.5,44.25 71,44.25 J8.5
  Bottom 0.127: U2.6 49.25,32.75 52.75,32.75 52.75,39.5 59,45.75 71,45.75 71,44.5 J8.5
MUX2_SC1  (via drill 0.3)
  Top 0.127: v51.5,43.75 51.75,44 59.5,44 R40.2 59.75,44.25 63.5,44.25 J9.5
  Bottom 0.127: v51.5,43.75 51.5,34.75 49.25,34.75 U2.9
MUX2_SC2  (via drill 0.3)
  Top 0.127: v56.25,34 56.25,32.25 65.25,32.25 67.25,30.25 R42.2 67.5,30.25 71,30.25 J10.5 | v56.25,18.5 37.25,18.5 37,18.25 U8.4
  Bottom 0.127: v56.25,34 U2.13 | v56.25,18.5 69.75,18.5 69.75,23.25 70.75,24.25 72.5,24.25 72.5,29 71.25,30.25 J10.5
MUX2_SC3  (via drill 0.3)
  Top 0.127: v56.75,31.75 58.25,30.25 59.5,30.25 R44.2 59.75,30.25 63.5,30.25 J11.5
  Bottom 0.127: v56.75,31.75 56.75,32 55,32 U2.16
MUX2_SD0  (via drill 0.3)
  Top 0.127: v56.25,39.5 57.5,40.75 65.75,40.75 67.25,39.25 R37.2 67.5,39.25 68.5,39.25 71,41.75 J8.4
  Bottom 0.127: v56.25,39.5 53.5,36.75 53.5,32 49.25,32 U2.5
MUX2_SD1  (via drill 0.3)
  Top 0.127: v48,37.75 49.25,39 54.75,39 | 54.75,39 59.5,39 R39.2 | 54.75,39 57,41.25 63,41.25 63.5,41.75 J9.4
  Bottom 0.127: v48,37.75 48,34 49,34 U2.8
MUX2_SD2  (via drill 0.3)
  Top 0.127: v36,19.75 36,19 U8.6 | v37.25,21.25 39.25,23.25 56,23.25 v58,25.25 59.5,26.75 65.75,26.75 67.25,25.25 R41.2 67.5,25.25 68.5,25.25 71,27.75 J10.4
  Bottom 0.127: v36,19.75 37.25,21 v37.25,21.25 | v58,25.25 54,29.25 54,34.5 54.75,34.5 U2.12
MUX2_SD3  (via drill 0.3)
  Top 0.127: v60.25,32.75 v56.75,32.75 | v62,26.25 60.75,26.25 59.75,25.25 R43.2
  Bottom 0.127: v56.75,32.75 55,32.75 U2.15 | v60.25,32.75 62.25,30.75 62.25,29.25 63.5,28 J11.4 63.5,27.75 v62,26.25
N$1  (via drill 0.3)
  Top 0.127: S1.B2 26,48.75 26.25,48.75 v27,49.5 29.75,49.5 v30.25,50
  Bottom 0.127: 31.25,50 31.25,52.75 C1.1 | 31.25,50 31.25,49.25 R2.2 | v27,49.5 28.25,50.75 R1.2 | v30.25,50 31.25,50
N$3  (via drill 0.3)
  Top 0.127: v44,3.5 44,4.75 J3.8
  Bottom 0.127: v44,3.5 44,2.5 R26.2
N$4  (via drill 0.3)
  Top 0.127: v52,3.5 52,4.75 J3.1
  Bottom 0.127: v52,3.5 52,2.5 R25.2
N$5  (via drill 0.3)
  Top 0.127: v56.25,19.25 60.75,14.75 D1.A
  Bottom 0.127: v56.25,19.25 54.75,20.75 R17.1
N$6
  Bottom 0.127: J17.2 32.25,5 32.25,4.25 31.75,3.75 31.75,1.5 32,1.25 37.5,1.25 37.5,7 37.75,7.25 R47.1
N$7  (via drill 0.3)
  Top 0.127: v50.75,16.75 56.75,16.75 60.75,12.75 D2.A
  Bottom 0.127: v50.75,16.75 50.25,17.25 50.25,19 R18.1
N$8
  Top 0.127: D9.C 33,2.25 35,2.25 R45.1
N$9
  Top 0.127: U4.10 17.75,6.5 17.75,4 18,4 R50.2 18,3.75 18,1.75 R49.1
N$10  (via drill 0.3)
  Top 0.127: v55.75,16 60.75,11 D3.A
  Bottom 0.127: v55.75,16 55,16.75 55,17 R19.1
N$11  (via drill 0.3)
  Top 0.127: v49.25,14.25 55.5,14.25 60.75,9 D4.A
  Bottom 0.127: v49.25,14.25 50,15 R20.1
N$12  (via drill 0.3)
  Top 0.127: v56,11.75 60.75,7 D5.A
  Bottom 0.127: v56,11.75 55,12.75 55,13.25 R21.1
N$13  (via drill 0.3)
  Top 0.127: v51.25,10.25 55.75,10.25 60.75,5.25 D6.A
  Bottom 0.127: v51.25,10.25 50.25,11.25 R22.1
N$14  (via drill 0.3)
  Top 0.127: v58,6 60.75,3.25 D7.A
  Bottom 0.127: v58,6 55,9 55,9.5 R23.1
N$15  (via drill 0.3)
  Top 0.127: v54,3.75 58.5,3.75 60.75,1.5 D8.A
  Bottom 0.127: v54,3.75 50.25,7.5 R24.1
N$16  (via drill 0.3)
  Top 0.127: v34.75,7.25 34.25,7.25 32.75,8.75 U5.1 | v35.5,5.5 35.5,4.5 35.25,4.5 R45.2
  Bottom 0.127: v34.75,7.25 35.5,6.5 v35.5,5.5
N$17
  Bottom 0.127: J17.3 31.75,5.75 31.5,6 31.5,6.5 32.25,7.25 33,7.25 R48.1
N$18
  Top 0.127: U4.4 20.75,8 21.25,8.5 21.25,9 20.75,9 20,9.75 14.5,9.75 13.95,9.2 U$1.2
N$19
  Top 0.127: U5.5 32.75,6.5 33,6.75 35.75,6.75 R46.2
N$20
  Top 0.127: U4.2 20.75,7 21.5,7.75 23.24,7.75 23.62,8.13 23.62,10.04 23.5,10.16 | 23.5,10.16 | 23.5,10.16 23.12,10.54 11.68,10.54 11.43,10.29 11.43,7.24 12.37,6.3 U$1.1
PGEC1
  Top 0.127: IC1.17 34,39.75 33,40.75 24.75,40.75 12.25,53.25 11.5,53.25 J12.5
PGED1  (via drill 0.3)
  Top 0.127: v14,50.75 24.5,40.25 33,40.25 33.75,39.5 IC1.18
  Bottom 0.127: v14,50.75 14,53.25 J12.4
RGB_DIN  (via drill 0.3)
  Top 0.127: v29.25,41.25 33.25,41.25 37.25,37.25 38,37.25 38.5,37.75 IC1.11 | v26,19.75 23,16.75 2.5,16.75 J13.3
  Bottom 0.127: v29.25,41.25 28.25,40.25 28.25,22 v26,19.75
SCK  (via drill 0.3)
  Top 0.127: v46,33.25 42,33.25 41.5,33.75 31,33.75 30.75,33.5 30.5,33.5 30.5,31.75 29.75,31 IC1.35
  Bottom 0.127: U3.12 45.75,12.75 45.75,33 v46,33.25 46,43.25 46.75,44 46.75,48.75 48,50 J4.4
SCL1  (via drill 0.3)
  Top 0.127: v25,30.5 26,29.5 29.75,29.5 30.25,30 IC1.37 30.5,30.25 33,32.75 v44.25,32.75 | v56.25,31.25 56.25,31.75 55.75,32.25 55.75,34.75 47.5,34.75 v45.5,36.75 | R28.2 45.5,43.5 45.5,46.25 J1.5
  Bottom 0.127: v25,30.5 25,31.5 23.25,31.5 U1.18 | v56.25,31.25 56.25,30.75 U2.18 | J1.5 45.5,46.25 v45.5,36.75 45.5,34 v44.25,32.75
SD_!SS  (via drill 0.3)
  Top 0.127: v46.5,8.5 49,6 50,6 50.5,5.5 50.5,5 J3.2
  Bottom 0.127: v46.5,8.5 46.5,7.25 U3.2
SD_MISO  (via drill 0.3)
  Top 0.127: v44.75,3.5 44.75,4.75 45,4.75 J3.7
  Bottom 0.127: v44.75,3.5 44.5,3.75 44.5,7 U3.5
SD_MOSI  (via drill 0.3)
  Top 0.127: v45,8.5 45.5,9 49.25,9 52.5,5.75 52.5,3 51,3 49.75,4.25 49.75,4.75 J3.3
  Bottom 0.127: v45,8.5 45,7.25 U3.4
SD_SCK  (via drill 0.3)
  Top 0.127: v45.75,8.5 47.25,7 47.25,5 J3.5
  Bottom 0.127: v45.75,8.5 45.75,7.25 U3.3
SDA1  (via drill 0.3)
  Top 0.127: v24.5,31 28,31 29,30 29.25,30 29.75,30.5 IC1.36 30,30.75 32.5,33.25 v40.75,33.25 | v57.25,42.25 56.25,43.25 48.25,43.25 R27.2 48,46.25 J1.4
  Bottom 0.127: v24.5,31 23.25,31 U1.19 | v57.25,42.25 57.25,30.25 55,30.25 U2.19 | v40.75,33.25 43.25,35.75 43.25,48.75 44.25,49.75 44.25,50.75 45,51.5 49.25,51.5 49.25,48 48.25,47 48.25,46.5 J1.4
U1CTS  (via drill 0.3)
  Top 0.127: v37.25,36.75 32.25,36.75 31.75,37.25 IC1.24
  Bottom 0.127: v37.25,36.75 38.75,38.25 38.75,49.25 42.25,52.75 45.25,52.75 45.25,53.75 J14.2
U1RX  (via drill 0.3)
  Top 0.127: v30,39.25 31,39.25 32.25,38 IC1.22
  Bottom 0.127: v30,39.25 29.75,39.5 29.75,53 32,55.25 46.75,55.25 46.75,53.5 47.5,52.75 50.5,52.75 50.5,53.75 J14.4
U1TX  (via drill 0.3)
  Top 0.127: v34.5,37.5 33.5,37.5 32.75,38.25 IC1.21 | v38.25,50.75 40.25,52.75 52,52.75 53,53.75 J14.5
  Bottom 0.127: v34.5,37.5 38.25,41.25 v38.25,50.75
V_BATT
  Top 0.127: U5.3 30.75,9 25.5,9 J16.2
  Bottom 0.127: C8.1 29.5,7.5 25.5,7.5 25.5,8.75 J16.2
VBATT  (via drill 0.3)
  Top 0.127: v16.25,7.5 17.5,7.5 U4.8 | v16.75,9.25 20,9.25 20.75,8.5 U4.5 | v21,9.5 21.5,9.5 22.25,8.75 C9.1
  Bottom 0.127: v16.25,7.5 16.25,8.75 v16.75,9.25 16.75,9.5 v21,9.5
VCAP
  Top 0.127: C11.1 44.75,30.5 42.5,28.25 40,28.25 39.5,28.75 IC1.56
VCC_USB  (via drill 0.3)
  Top 0.127: 30.75,3.5 30.75,4.25 C7.1 31,4.5 31,6.25 | 30.75,3.5 30.75,2.5 D9.A | 31,6.25 v32,6.25 | 31,6.25 U5.4 | 30.75,3.5 38,3.5 38.5,4 J15.2
  Bottom 0.127: v32,6.25 32.75,6.25 33,6 33,5.25 J17.1

### Text on the board
tNames: V | V | V | V | | | !RESET | UART | SPI_1 | I2C_1 | H.A.L.O. Main Board / Hunter Hykes / 2021/02/15 | P1 | P0 | P0 | P1 | A2 | A1 | A0 | MUX_1 ADDR | A2 | A1 | A0 | MUX_2 ADDR | Y | P3 | P2 | P2 | P3 | X | RGB | Z | ACCEL. | + / - | Buck/Boost | Charger | + / - | BATT | + / - | + / -
bNames: MUX_1 | MUX_2 | Buck/Boost | Charger